# Altium project Angler_Main_PCB_V2.PrjPcb
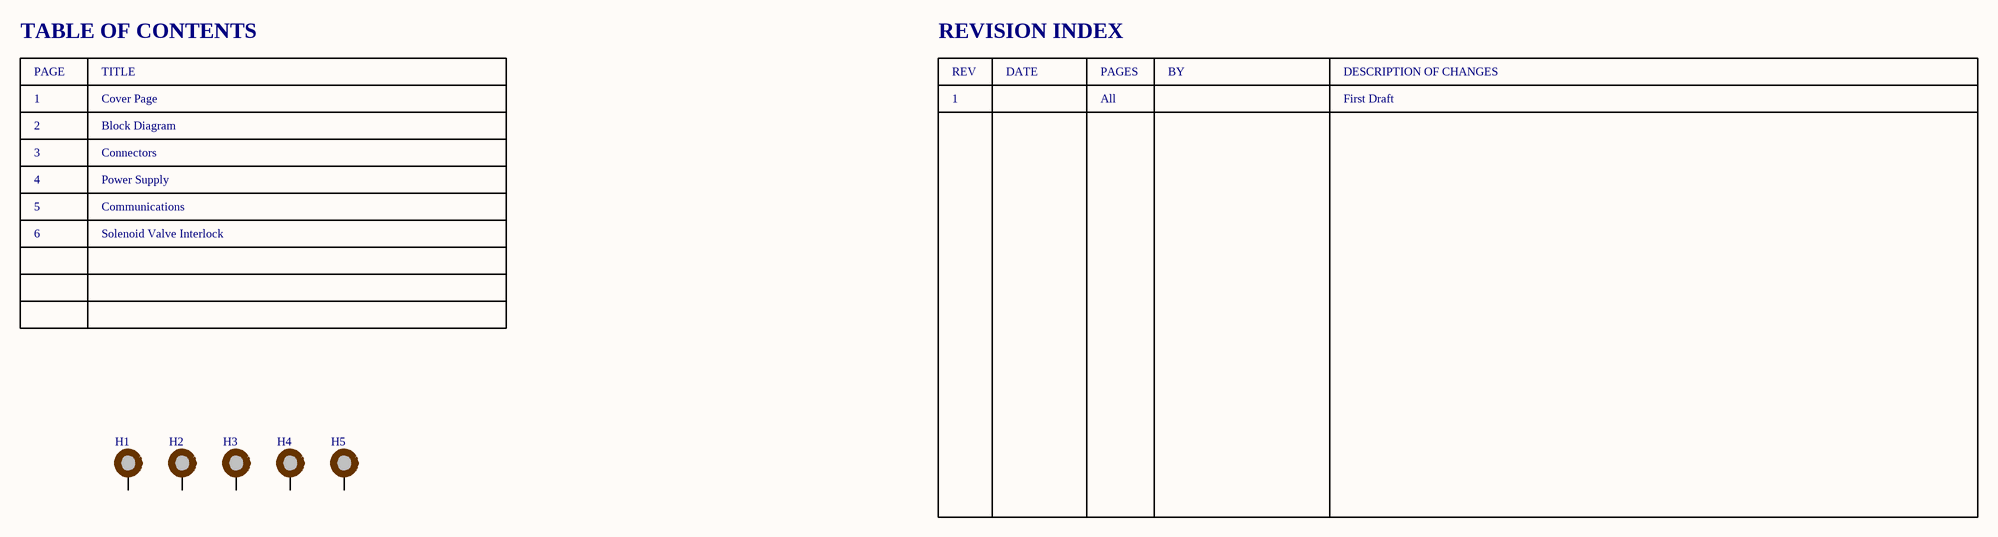
[diagram p0: S1_Cover_Page.SchDoc]
Copyright: Copyright 2020; DrawnBy: Dhrumil Parikh; PageSize: T; PCBDate: 01-Mar-2020; PCBName: AquaDrone Main PCB V2; PCBPartNumber: AD-PCB-002; PCBRevision: 1.0; ProjectTitle: AquaDrone Main PCB V2; SchDate: 01-Mar-2020; SchDrawnBy: Dhrumil Parikh; SchNumber: AD-SCH-002; SchRevision: 1; SheetTotal: 5
6 sheets, 202 parts. Net scope: flat (ports and power ports of the same name join across sheets).
Board file: AquaDrone_Main_PCB_V2.PcbDoc
Sheets:
  S1_Cover_Page.SchDoc
  S2_Block_Diagram.SchDoc
  S3_Connectors.SchDoc
  S4_Power_Supply.SchDoc
  S5_Communications.SchDoc
  S6_Solenoid_Valve_Interlock.SchDoc

## Sheet S1_Cover_Page.SchDoc: Cover Page
size Tabloid; DrawnBy: Dhrumil Parikh; SheetNumber: 1; SheetTotal: 6; PageSetup: Record=PageOptions|CenterHorizontal=True|CenterVertical=True|PrintScale=0.62|XCorrection=1.00|YCorrection=1.00|PrintKind=1|BorderSize=5000000|LeftOffset=0|BottomOffset=0|Orientation=2|PaperLength=1000|PaperWidth=1000|Scale=100|PaperSource=7|PrintQuality=600|MediaType=1|DitherType=10|PaperKind=Letter|PrintScaleMode=1; PageSize: T

### Parts
H1  MTG_HOLE PTH, 3.0mm  [MH_PTH_H3.0mmXP6.0mm]  (value not drawn)  (no BOM)
H2  MTG_HOLE PTH, 3.0mm  [MH_PTH_H3.0mmXP6.0mm]  (value not drawn)  (no BOM)
H3  MTG_HOLE PTH, 3.0mm  [MH_PTH_H3.0mmXP6.0mm]  (value not drawn)  (no BOM)
H4  MTG_HOLE PTH, 3.0mm  [MH_PTH_H3.0mmXP6.0mm]  (value not drawn)  (no BOM)
H5  MTG_HOLE PTH, 3.0mm  [MH_PTH_H3.0mmXP6.0mm]  (value not drawn)  (no BOM)

### Nets

Not connected (* = marked no-connect by the designer): H1 1; H2 1; H3 1; H4 1; H5 1

### Notes on the sheet
- TABLE OF CONTENTS
- PAGE
- 1
- TITLE
- Cover Page
- REVISION INDEX
- REV
- DATE
- PAGES
- All
- BY
- DESCRIPTION OF CHANGES
- First Draft
- 2
- 3
- Block Diagram
- Connectors
- 4
- 5
- 6
- Power Supply
- Communications
- Solenoid Valve Interlock
- Title:
- Project:
- Size:
- Date:
- DrawnBy:
- Rev:
- Project Lead:
- Sheet
- Dhrumil Parikh
- of
- 200 University Ave W
- Waterloo, ON
- N2L 3G1, Canada
- File:

### Library data of the parts
H1-H5 = MTG_HOLE PTH, 3.0mm: PTH, 3.0mm; VALUE: PTH_3.0MM

## Sheet S2_Block_Diagram.SchDoc: Block Diagram
size Tabloid; DrawnBy: Dhrumil Parikh; SheetNumber: 2; SheetTotal: 6; PageSetup: Record=PageOptions|CenterHorizontal=True|CenterVertical=True|PrintScale=0.62|XCorrection=1.00|YCorrection=1.00|PrintKind=1|BorderSize=5000000|LeftOffset=0|BottomOffset=0|Orientation=2|PaperLength=1000|PaperWidth=1000|Scale=100|PaperSource=7|PrintQuality=600|MediaType=1|DitherType=10|PaperKind=Letter|PrintScaleMode=1; PageSize: T

### Notes on the sheet
- Title:
- Project:
- Size:
- Date:
- DrawnBy:
- Rev:
- Project Lead:
- Sheet
- Dhrumil Parikh
- of
- 200 University Ave W
- Waterloo, ON
- N2L 3G1, Canada
- File:

## Sheet S3_Connectors.SchDoc: Connectors
size Tabloid; DrawnBy: Dhrumil Parikh; SheetNumber: 3; SheetTotal: 6; PageSetup: Record=PageOptions|CenterHorizontal=True|CenterVertical=True|PrintScale=0.62|XCorrection=1.00|YCorrection=1.00|PrintKind=1|BorderSize=5000000|LeftOffset=0|BottomOffset=0|Orientation=2|PaperLength=1000|PaperWidth=1000|Scale=100|PaperSource=7|PrintQuality=600|MediaType=1|DitherType=10|PaperKind=Letter|PrintScaleMode=1; PageSize: T
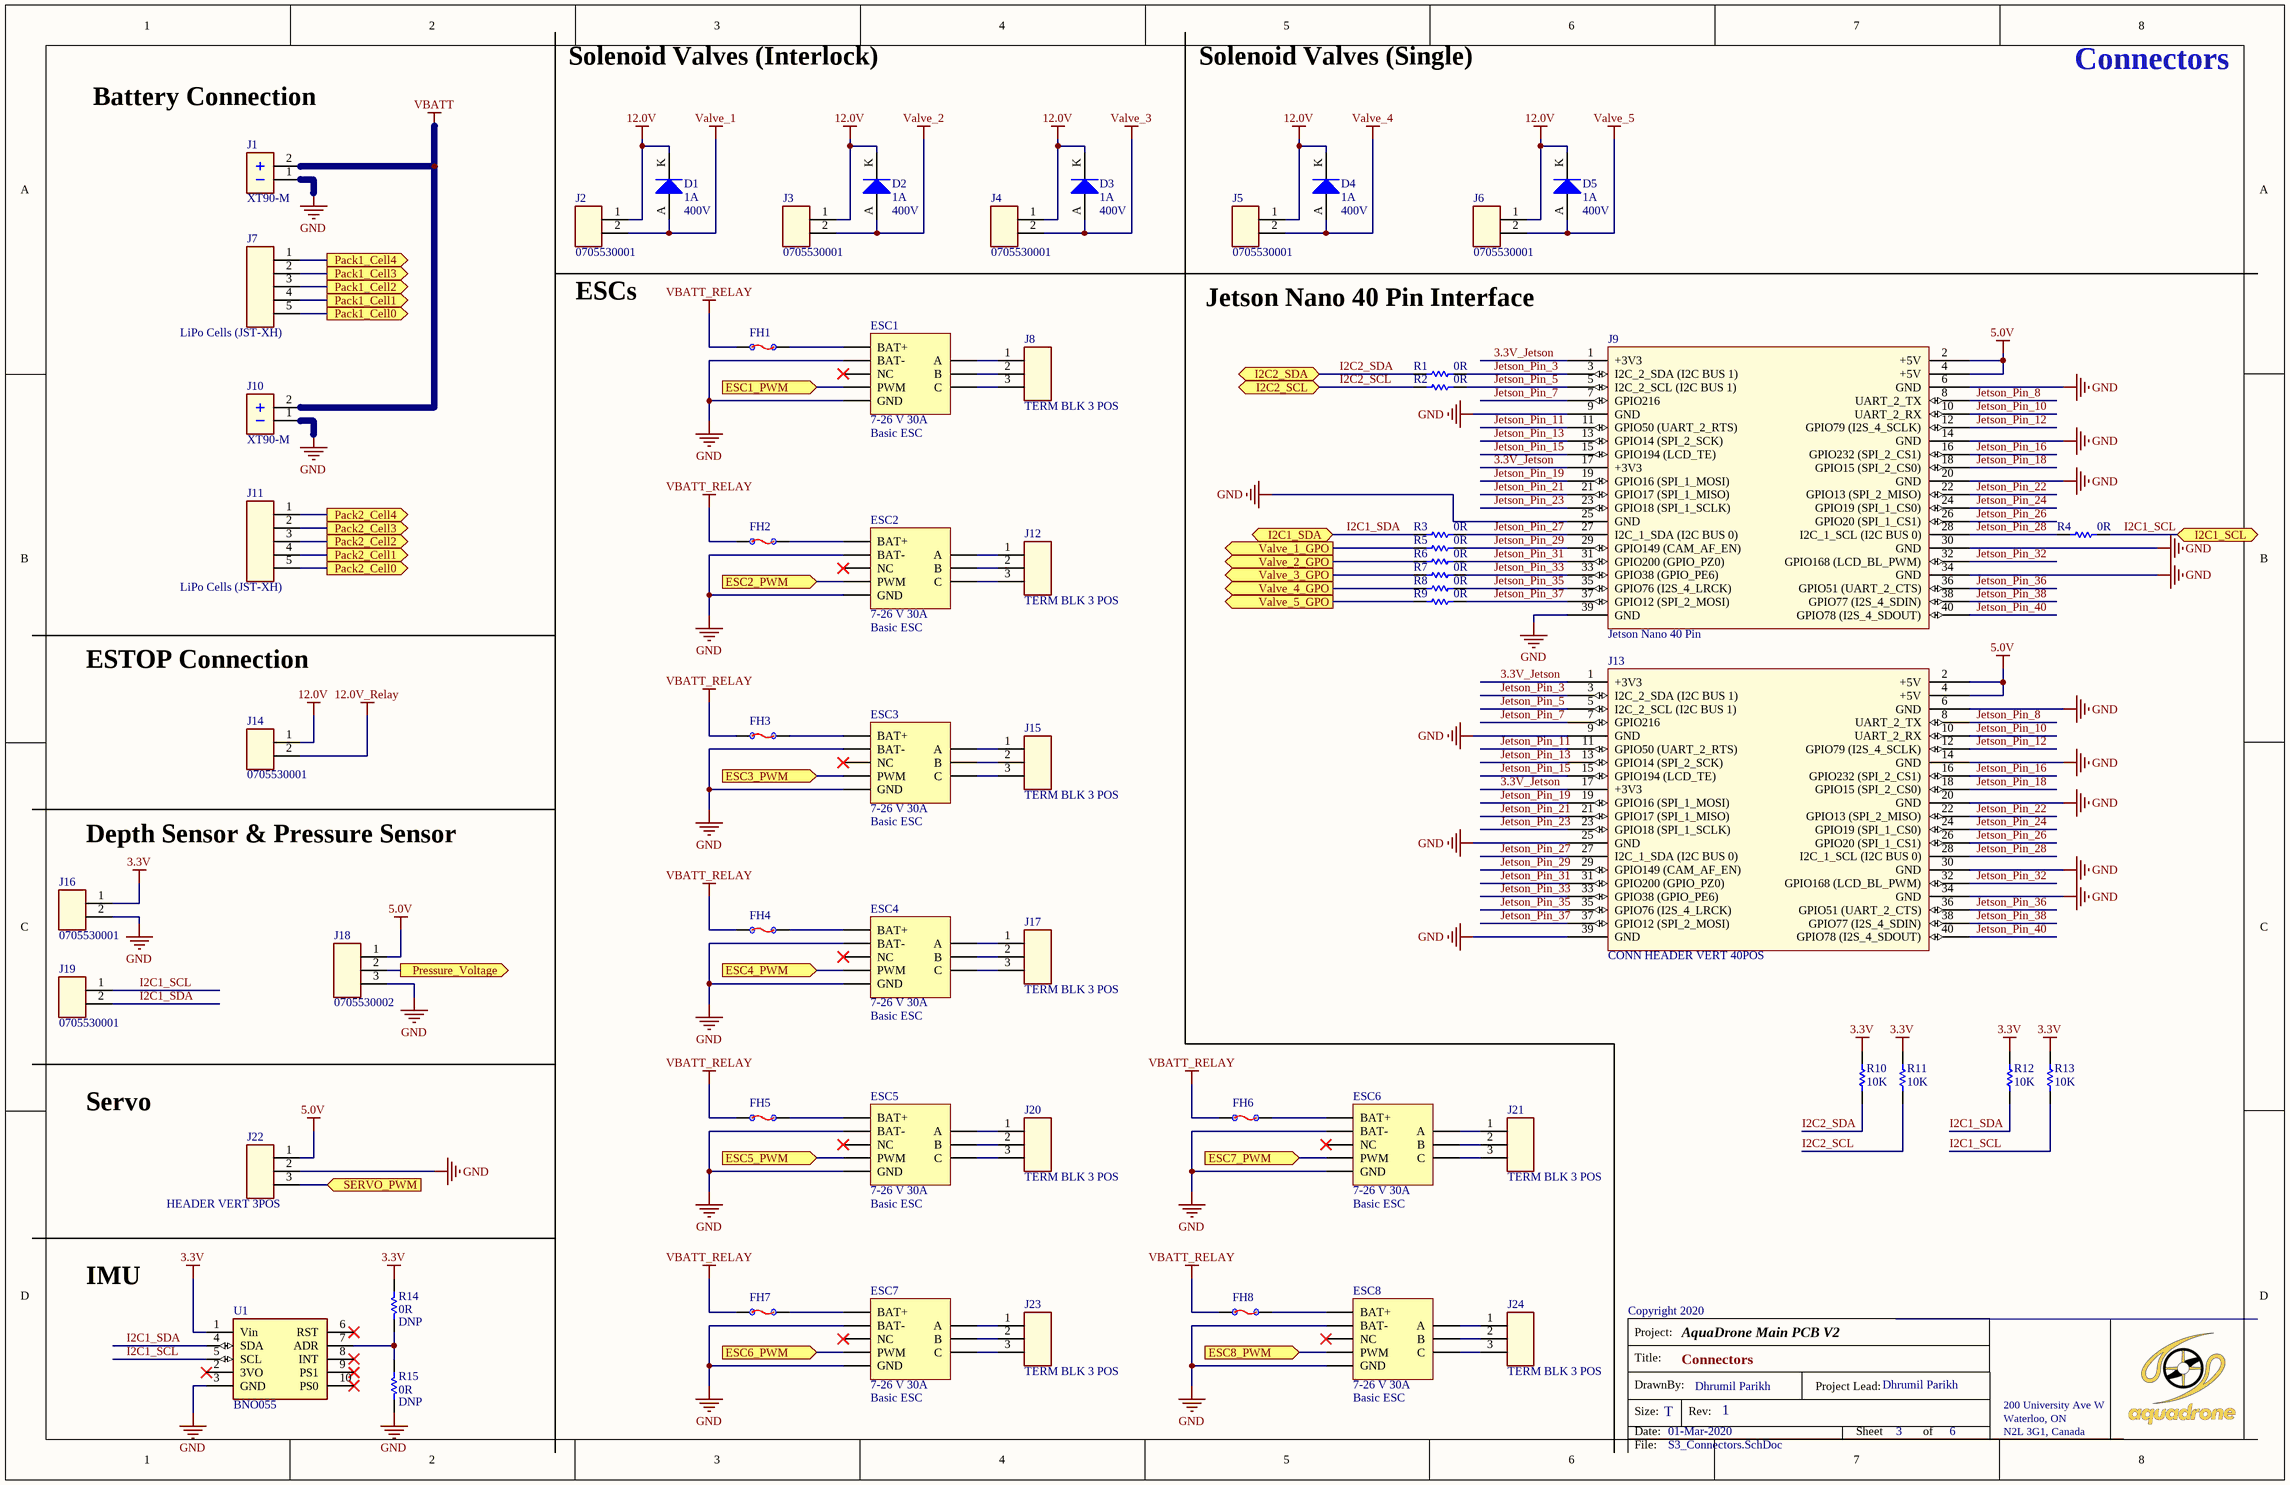
[diagram p1: S3_Connectors.SchDoc]

### Parts
D1  CURRENT: 1A  VR: 400V  [DIOM5226X295N]  (hidden comment: DIODE GEN PURP 400V 1A SMA)
D2  CURRENT: 1A  VR: 400V  [DIOM5226X295N]  (hidden comment: DIODE GEN PURP 400V 1A SMA)
D3  CURRENT: 1A  VR: 400V  [DIOM5226X295N]  (hidden comment: DIODE GEN PURP 400V 1A SMA)
D4  CURRENT: 1A  VR: 400V  [DIOM5226X295N]  (hidden comment: DIODE GEN PURP 400V 1A SMA)
D5  CURRENT: 1A  VR: 400V  [DIOM5226X295N]  (hidden comment: DIODE GEN PURP 400V 1A SMA)
ESC1  VOLTAGE: 7-26 V 30A  [ESC BR]  (hidden comment: Basic ESC)
ESC2  VOLTAGE: 7-26 V 30A  [ESC BR]  (hidden comment: Basic ESC)
ESC3  VOLTAGE: 7-26 V 30A  [ESC BR]  (hidden comment: Basic ESC)
ESC4  VOLTAGE: 7-26 V 30A  [ESC BR]  (hidden comment: Basic ESC)
ESC5  VOLTAGE: 7-26 V 30A  [ESC BR]  (hidden comment: Basic ESC)
ESC6  VOLTAGE: 7-26 V 30A  [ESC BR]  (hidden comment: Basic ESC)
ESC7  VOLTAGE: 7-26 V 30A  [ESC BR]  (hidden comment: Basic ESC)
ESC8  VOLTAGE: 7-26 V 30A  [ESC BR]  (hidden comment: Basic ESC)
FH1  FUSE BLOK CARTRIDGE 600V 16A PCB  [FUSE-HOLDER(5X20)]  (value not drawn)
FH2  FUSE BLOK CARTRIDGE 600V 16A PCB  [FUSE-HOLDER(5X20)]  (value not drawn)
FH3  FUSE BLOK CARTRIDGE 600V 16A PCB  [FUSE-HOLDER(5X20)]  (value not drawn)
FH4  FUSE BLOK CARTRIDGE 600V 16A PCB  [FUSE-HOLDER(5X20)]  (value not drawn)
FH5  FUSE BLOK CARTRIDGE 600V 16A PCB  [FUSE-HOLDER(5X20)]  (value not drawn)
FH6  FUSE BLOK CARTRIDGE 600V 16A PCB  [FUSE-HOLDER(5X20)]  (value not drawn)
FH7  FUSE BLOK CARTRIDGE 600V 16A PCB  [FUSE-HOLDER(5X20)]  (value not drawn)
FH8  FUSE BLOK CARTRIDGE 600V 16A PCB  [FUSE-HOLDER(5X20)]  (value not drawn)
J1  value XT90-M  [XT90]  (hidden comment: CONN XT90 MALE)
J2  value 0705530001  [SHDRRA2W109P0_254_1X2_762X1359X699P]  (hidden comment: CONN HEADER R/A 2POS 2.54MM)
J3  value 0705530001  [SHDRRA2W109P0_254_1X2_762X1359X699P]  (hidden comment: CONN HEADER R/A 2POS 2.54MM)
J4  value 0705530001  [SHDRRA2W109P0_254_1X2_762X1359X699P]  (hidden comment: CONN HEADER R/A 2POS 2.54MM)
J5  value 0705530001  [SHDRRA2W109P0_254_1X2_762X1359X699P]  (hidden comment: CONN HEADER R/A 2POS 2.54MM)
J6  value 0705530001  [SHDRRA2W109P0_254_1X2_762X1359X699P]  (hidden comment: CONN HEADER R/A 2POS 2.54MM)
J7  value LiPo Cells (JST-XH)  [SHDR5W64P0X250_1X5_1490X1150X610P]  (hidden comment: CONN HEADER R/A 5POS 2.5MM)
J8  value TERM BLK 3 POS  [SHDR3W100P0X254_1X3_808X650X1030P]  (hidden comment: TERM BLK 3P SIDE ENT 2.54MM PCB)
J9  value Jetson Nano 40 Pin  [Jetson Nano]  (hidden comment: Jetson Nano 40 Pin Interface)
J10  value XT90-M  [XT90]  (hidden comment: CONN XT90 MALE)
J11  value LiPo Cells (JST-XH)  [SHDR5W64P0X250_1X5_1490X1150X610P]  (hidden comment: CONN HEADER R/A 5POS 2.5MM)
J12  value TERM BLK 3 POS  [SHDR3W100P0X254_1X3_808X650X1030P]  (hidden comment: TERM BLK 3P SIDE ENT 2.54MM PCB)
J13  value CONN HEADER VERT 40POS  [67997-140HLF]  (hidden comment: CONN HEADER VERT 40POS 2.54MM)
J14  value 0705530001  [SHDRRA2W109P0_254_1X2_762X1359X699P]  (hidden comment: CONN HEADER R/A 2POS 2.54MM)
J15  value TERM BLK 3 POS  [SHDR3W100P0X254_1X3_808X650X1030P]  (hidden comment: TERM BLK 3P SIDE ENT 2.54MM PCB)
J16  value 0705530001  [SHDRRA2W109P0_254_1X2_762X1359X699P]  (hidden comment: CONN HEADER R/A 2POS 2.54MM)
J17  value TERM BLK 3 POS  [SHDR3W100P0X254_1X3_808X650X1030P]  (hidden comment: TERM BLK 3P SIDE ENT 2.54MM PCB)
J18  value 0705530002  [SHDR3W89P0X254_1X3_1017X1359X699P]  (hidden comment: CONN HEADER R/A 3POS 2.54MM)
J19  value 0705530001  [SHDRRA2W109P0_254_1X2_762X1359X699P]  (hidden comment: CONN HEADER R/A 2POS 2.54MM)
J20  value TERM BLK 3 POS  [SHDR3W100P0X254_1X3_808X650X1030P]  (hidden comment: TERM BLK 3P SIDE ENT 2.54MM PCB)
J21  value TERM BLK 3 POS  [SHDR3W100P0X254_1X3_808X650X1030P]  (hidden comment: TERM BLK 3P SIDE ENT 2.54MM PCB)
J22  value HEADER VERT 3POS  [61300311121]  (hidden comment: CONN HEADER VERT 3POS 2.54MM)
J23  value TERM BLK 3 POS  [SHDR3W100P0X254_1X3_808X650X1030P]  (hidden comment: TERM BLK 3P SIDE ENT 2.54MM PCB)
J24  value TERM BLK 3 POS  [SHDR3W100P0X254_1X3_808X650X1030P]  (hidden comment: TERM BLK 3P SIDE ENT 2.54MM PCB)
R1  value 0R  [RESC2012X07N]  (hidden comment: RES SMD 0 OHM JUMPER 1/8W 0805)
R2  value 0R  [RESC2012X07N]  (hidden comment: RES SMD 0 OHM JUMPER 1/8W 0805)
R3  value 0R  [RESC2012X07N]  (hidden comment: RES SMD 0 OHM JUMPER 1/8W 0805)
R4  value 0R  [RESC2012X07N]  (hidden comment: RES SMD 0 OHM JUMPER 1/8W 0805)
R5  value 0R  [RESC2012X07N]  (hidden comment: RES SMD 0 OHM JUMPER 1/8W 0805)
R6  value 0R  [RESC2012X07N]  (hidden comment: RES SMD 0 OHM JUMPER 1/8W 0805)
R7  value 0R  [RESC2012X07N]  (hidden comment: RES SMD 0 OHM JUMPER 1/8W 0805)
R8  value 0R  [RESC2012X07N]  (hidden comment: RES SMD 0 OHM JUMPER 1/8W 0805)
R9  value 0R  [RESC2012X07N]  (hidden comment: RES SMD 0 OHM JUMPER 1/8W 0805)
R10  value 10K  [RESC1608X06N]  (hidden comment: RES SMD 10K OHM 1% 1/10W 0603)
R11  value 10K  [RESC1608X06N]  (hidden comment: RES SMD 10K OHM 1% 1/10W 0603)
R12  value 10K  [RESC1608X06N]  (hidden comment: RES SMD 10K OHM 1% 1/10W 0603)
R13  value 10K  [RESC1608X06N]  (hidden comment: RES SMD 10K OHM 1% 1/10W 0603)
R14  value 0R  NOSTUFF: DNP  [RESC2012X07N]  (hidden comment: RES SMD 0 OHM JUMPER 1/8W 0805)
R15  value 0R  NOSTUFF: DNP  [RESC2012X07N]  (hidden comment: RES SMD 0 OHM JUMPER 1/8W 0805)
U1  IC BNO055  [BNO055]  (value not drawn)

### Ports
ESC1_PWM (in), ESC2_PWM (in), ESC3_PWM (in), ESC4_PWM (in), ESC5_PWM (in), ESC6_PWM (in), ESC7_PWM (in), ESC8_PWM (in), I2C1_SCL (bidir), I2C1_SDA (bidir), I2C2_SCL (bidir), I2C2_SDA (bidir), Pack1_Cell0 (out), Pack1_Cell1 (out), Pack1_Cell2 (out), Pack1_Cell3 (out), Pack1_Cell4 (out), Pack2_Cell0 (out), Pack2_Cell1 (out), Pack2_Cell2 (out), Pack2_Cell3 (out), Pack2_Cell4 (out), Pressure_Voltage (out), SERVO_PWM (in), Valve_1_GPO (out), Valve_2_GPO (out), Valve_3_GPO (out), Valve_4_GPO (out), Valve_5_GPO (out)

### Nets
3.3V: J16.1 R10.2 R11.2 R12.2 R13.2 R14.1 U1.1(Vin)
5.0V: J9.2(+5V) J9.4(+5V) J13.2(+5V) J13.4(+5V) J18.1 J22.1
12.0V: D1.K D2.K D3.K D4.K D5.K J2.1 J3.1 J4.1 J5.1 J6.1 J14.1
12.0V_Relay: J14.2
GND: ESC1.BAT- ESC1.GND ESC2.BAT- ESC2.GND ESC3.BAT- ESC3.GND ESC4.BAT- ESC4.GND ESC5.BAT- ESC5.GND ESC6.BAT- ESC6.GND ESC7.BAT- ESC7.GND ESC8.BAT- ESC8.GND J1.1 J9.6(GND) J9.9(GND) J9.14(GND) J9.20(GND) J9.25(GND) J9.30(GND) J9.34(GND) J9.39(GND) J10.1 J13.6(GND) J13.9(GND) J13.14(GND) J13.20(GND) J13.25(GND) J13.30(GND) J13.34(GND) J13.39(GND) J16.2 J18.3 J22.2 R15.2 U1.3(GND)
Valve_1: D1.A J2.2
Valve_2: D2.A J3.2
Valve_3: D3.A J4.2
Valve_4: D4.A J5.2
Valve_5: D5.A J6.2
VBATT: J1.2 J10.2
VBATT_RELAY: FH1.1 FH2.1 FH3.1 FH4.1 FH5.1 FH6.1 FH7.1 FH8.1
3.3V_Jetson: J9.1(+3V3) J9.17(+3V3) J13.1(+3V3) J13.17(+3V3)  [project net 3.3V_Jetson_3]
ESC1_PWM: ESC1.PWM ; port ESC1_PWM
ESC2_PWM: ESC2.PWM ; port ESC2_PWM
ESC3_PWM: ESC3.PWM ; port ESC3_PWM
ESC4_PWM: ESC4.PWM ; port ESC4_PWM
ESC5_PWM: ESC5.PWM ; port ESC5_PWM
ESC6_PWM: ESC7.PWM ; port ESC6_PWM
ESC7_PWM: ESC6.PWM ; port ESC7_PWM
ESC8_PWM: ESC8.PWM ; port ESC8_PWM
I2C1_SCL: J19.1 R4.2 R13.1 U1.5(SCL) ; port I2C1_SCL
I2C1_SDA: J19.2 R3.1 R12.1 U1.4(SDA) ; port I2C1_SDA
I2C2_SCL: R2.1 R11.1 ; port I2C2_SCL
I2C2_SDA: R1.1 R10.1 ; port I2C2_SDA
Jetson_Pin_3: J9.3(I2C_2_SDA_(I2C_BUS_1)) J13.3(I2C_2_SDA_(I2C_BUS_1)) R1.2  [project net Jetson_Pin_3_3]
Jetson_Pin_5: J9.5(I2C_2_SCL_(I2C_BUS_1)) J13.5(I2C_2_SCL_(I2C_BUS_1)) R2.2  [project net Jetson_Pin_5_3]
Jetson_Pin_7: J9.7(GPIO216) J13.7(GPIO216)  [project net Jetson_Pin_7_3]
Jetson_Pin_8: J9.8(UART_2_TX) J13.8(UART_2_TX)  [project net Jetson_Pin_8_3]
Jetson_Pin_10: J9.10(UART_2_RX) J13.10(UART_2_RX)  [project net Jetson_Pin_10_3]
Jetson_Pin_11: J9.11(GPIO50_(UART_2_RTS)) J13.11(GPIO50_(UART_2_RTS))  [project net Jetson_Pin_11_3]
Jetson_Pin_12: J9.12(GPIO79_(I2S_4_SCLK)) J13.12(GPIO79_(I2S_4_SCLK))  [project net Jetson_Pin_12_3]
Jetson_Pin_13: J9.13(GPIO14_(SPI_2_SCK)) J13.13(GPIO14_(SPI_2_SCK))  [project net Jetson_Pin_13_3]
Jetson_Pin_15: J9.15(GPIO194_(LCD_TE)) J13.15(GPIO194_(LCD_TE))  [project net Jetson_Pin_15_3]
Jetson_Pin_16: J9.16(GPIO232_(SPI_2_CS1)) J13.16(GPIO232_(SPI_2_CS1))  [project net Jetson_Pin_16_3]
Jetson_Pin_18: J9.18(GPIO15_(SPI_2_CS0)) J13.18(GPIO15_(SPI_2_CS0))  [project net Jetson_Pin_18_3]
Jetson_Pin_19: J9.19(GPIO16_(SPI_1_MOSI)) J13.19(GPIO16_(SPI_1_MOSI))  [project net Jetson_Pin_19_3]
Jetson_Pin_21: J9.21(GPIO17_(SPI_1_MISO)) J13.21(GPIO17_(SPI_1_MISO))  [project net Jetson_Pin_21_3]
Jetson_Pin_22: J9.22(GPIO13_(SPI_2_MISO)) J13.22(GPIO13_(SPI_2_MISO))  [project net Jetson_Pin_22_3]
Jetson_Pin_23: J9.23(GPIO18_(SPI_1_SCLK)) J13.23(GPIO18_(SPI_1_SCLK))  [project net Jetson_Pin_23_3]
Jetson_Pin_24: J9.24(GPIO19_(SPI_1_CS0)) J13.24(GPIO19_(SPI_1_CS0))  [project net Jetson_Pin_24_3]
Jetson_Pin_26: J9.26(GPIO20_(SPI_1_CS1)) J13.26(GPIO20_(SPI_1_CS1))  [project net Jetson_Pin_26_3]
Jetson_Pin_27: J9.27(I2C_1_SDA_(I2C_BUS_0)) J13.27(I2C_1_SDA_(I2C_BUS_0)) R3.2  [project net Jetson_Pin_27_3]
Jetson_Pin_28: J9.28(I2C_1_SCL_(I2C_BUS_0)) J13.28(I2C_1_SCL_(I2C_BUS_0)) R4.1  [project net Jetson_Pin_28_3]
Jetson_Pin_29: J9.29(GPIO149_(CAM_AF_EN)) J13.29(GPIO149_(CAM_AF_EN)) R5.2  [project net Jetson_Pin_29_3]
Jetson_Pin_31: J9.31(GPIO200_(GPIO_PZ0)) J13.31(GPIO200_(GPIO_PZ0)) R6.2  [project net Jetson_Pin_31_3]
Jetson_Pin_32: J9.32(GPIO168_(LCD_BL_PWM)) J13.32(GPIO168_(LCD_BL_PWM))  [project net Jetson_Pin_32_3]
Jetson_Pin_33: J9.33(GPIO38_(GPIO_PE6)) J13.33(GPIO38_(GPIO_PE6)) R7.2  [project net Jetson_Pin_33_3]
Jetson_Pin_35: J9.35(GPIO76_(I2S_4_LRCK)) J13.35(GPIO76_(I2S_4_LRCK)) R8.2  [project net Jetson_Pin_35_3]
Jetson_Pin_36: J9.36(GPIO51_(UART_2_CTS)) J13.36(GPIO51_(UART_2_CTS))  [project net Jetson_Pin_36_3]
Jetson_Pin_37: J9.37(GPIO12_(SPI_2_MOSI)) J13.37(GPIO12_(SPI_2_MOSI)) R9.2  [project net Jetson_Pin_37_3]
Jetson_Pin_38: J9.38(GPIO77_(I2S_4_SDIN)) J13.38(GPIO77_(I2S_4_SDIN))  [project net Jetson_Pin_38_3]
Jetson_Pin_40: J9.40(GPIO78_(I2S_4_SDOUT)) J13.40(GPIO78_(I2S_4_SDOUT))  [project net Jetson_Pin_40_3]
Pack1_Cell0: J7.5 ; port Pack1_Cell0
Pack1_Cell1: J7.4 ; port Pack1_Cell1
Pack1_Cell2: J7.3 ; port Pack1_Cell2
Pack1_Cell3: J7.2 ; port Pack1_Cell3
Pack1_Cell4: J7.1 ; port Pack1_Cell4
Pack2_Cell0: J11.5 ; port Pack2_Cell0
Pack2_Cell1: J11.4 ; port Pack2_Cell1
Pack2_Cell2: J11.3 ; port Pack2_Cell2
Pack2_Cell3: J11.2 ; port Pack2_Cell3
Pack2_Cell4: J11.1 ; port Pack2_Cell4
Pressure_Voltage: J18.2 ; port Pressure_Voltage
SERVO_PWM: J22.3 ; port SERVO_PWM
Valve_1_GPO: R5.1 ; port Valve_1_GPO
Valve_2_GPO: R6.1 ; port Valve_2_GPO
Valve_3_GPO: R7.1 ; port Valve_3_GPO
Valve_4_GPO: R8.1 ; port Valve_4_GPO
Valve_5_GPO: R9.1 ; port Valve_5_GPO
NetESC1_A: ESC1.A J8.1
NetESC1_B: ESC1.B J8.2
NetESC1_BAT+: ESC1.BAT+ FH1.2
NetESC1_C: ESC1.C J8.3
NetESC2_A: ESC2.A J12.1
NetESC2_B: ESC2.B J12.2
NetESC2_BAT+: ESC2.BAT+ FH2.2
NetESC2_C: ESC2.C J12.3
NetESC3_A: ESC3.A J15.1
NetESC3_B: ESC3.B J15.2
NetESC3_BAT+: ESC3.BAT+ FH3.2
NetESC3_C: ESC3.C J15.3
NetESC4_A: ESC4.A J17.1
NetESC4_B: ESC4.B J17.2
NetESC4_BAT+: ESC4.BAT+ FH4.2
NetESC4_C: ESC4.C J17.3
NetESC5_A: ESC5.A J20.1
NetESC5_B: ESC5.B J20.2
NetESC5_BAT+: ESC5.BAT+ FH5.2
NetESC5_C: ESC5.C J20.3
NetESC6_A: ESC6.A J21.1
NetESC6_B: ESC6.B J21.2
NetESC6_BAT+: ESC6.BAT+ FH6.2
NetESC6_C: ESC6.C J21.3
NetESC7_A: ESC7.A J23.1
NetESC7_B: ESC7.B J23.2
NetESC7_BAT+: ESC7.BAT+ FH7.2
NetESC7_C: ESC7.C J23.3
NetESC8_A: ESC8.A J24.1
NetESC8_B: ESC8.B J24.2
NetESC8_BAT+: ESC8.BAT+ FH8.2
NetESC8_C: ESC8.C J24.3
NetR14_2: R14.2 R15.1 U1.7(ADR)

Not connected (* = marked no-connect by the designer): ESC1 NC*; ESC2 NC*; ESC3 NC*; ESC4 NC*; ESC5 NC*; ESC6 NC*; ESC7 NC*; ESC8 NC*; U1 2(3VO)* 6(RST)* 8(INT)* 9(PS1)* 10(PS0)*

### Notes on the sheet
- Solenoid Valves (Interlock)
- Solenoid Valves (Single)
- Battery Connection
- (near J2) ESCs
- Jetson Nano 40 Pin Interface
- ESTOP Connection
- Depth Sensor & Pressure Sensor
- Servo
- IMU
- Title:
- Project:
- Size:
- Date:
- DrawnBy:
- Rev:
- Project Lead:
- Sheet
- Dhrumil Parikh
- of
- 200 University Ave W
- Waterloo, ON
- N2L 3G1, Canada
- File:

### Library data of the parts
D1-D5 = DIODE GEN PURP 400V 1A SMA: MFG_PART_NO: S1GTR; MFG: SMC Diode Solutions; VALUE: S1GTR; COST: 0.17
ESC1-ESC8 = Basic ESC: MFG_PART_NO: BESC30-R3; COST1K: 25; MFG: Blue Robotics; ROHS: Y; VALUE: Basic ESC
FH1-FH8 = FUSE BLOK CARTRIDGE 600V 16A PCB: MFG_PART_NO: 0031.8231; MFG: Schurter Inc.; HOLD: 14A; VALUE: Fuse Holder; TRIP: 15A; COST: 2.89; VOLTAGE: 600V
J1 J10 = CONN XT90 MALE: MFG_PART_NO: FIT0588; MFG: DFRobot; COST: 5.66000
J2-J6 J14 J16 J19 = CONN HEADER R/A 2POS 2.54MM: MFG: Molex; COST: 1.12; MFG_PART_NO: 0705530001
J7 J11 = CONN HEADER R/A 5POS 2.5MM: MFG_PART_NO: S5B-XH-A(LF)(SN); MFG: JST Sales America Inc.; COST: 0.43
J8 J12 J15 J17 J20 J21 J23 J24 = TERM BLK 3P SIDE ENT 2.54MM PCB: MFG_PART_NO: 282834-3; MFG: TE Connectivity; COST: 2.9
J13 = CONN HEADER VERT 40POS 2.54MM: MFG: Amphenol; COST: 4.1; MFG_PART_NO: 67997-140HLF
J18 = CONN HEADER R/A 3POS 2.54MM: MFG: Molex; COST: 1.47; MFG_PART_NO: 0705530002
J22 = CONN HEADER VERT 3POS 2.54MM: MFG: Wurth Electronics Inc.; COST: 0.18; MFG_PART_NO: 61300311121
R1-R9 R14 R15 = RES SMD 0 OHM JUMPER 1/8W 0805: MFG_PART_NO: ERJ-6GEY0R00V; MFG: Panasonic; COST: 0.15
R10-R13 = RES SMD 10K OHM 1% 1/10W 0603: MFG_PART_NO: CRCW060310K0FKEA; MFG: Vishay Dale; COST: 0.15; TOLERANCE: 1%
U1 = IC BNO055: MFG: Adafruit Industries LLC; COST: 50; VALUE: BNO055; MFG_PART_NO: BNO055
J9 = Jetson Nano 40 Pin Interface: COST: 60; MFG: Jetson; MFG_PART_NO: Nano

## Sheet S4_Power_Supply.SchDoc: Power Supply
size Tabloid; DrawnBy: Dhrumil Parikh; SheetNumber: 4; SheetTotal: 6; PageSetup: Record=PageOptions|CenterHorizontal=True|CenterVertical=True|PrintScale=0.62|XCorrection=1.00|YCorrection=1.00|PrintKind=1|BorderSize=5000000|LeftOffset=0|BottomOffset=0|Orientation=2|PaperLength=1000|PaperWidth=1000|Scale=100|PaperSource=7|PrintQuality=600|MediaType=1|DitherType=10|PaperKind=Letter|PrintScaleMode=1; PageSize: T
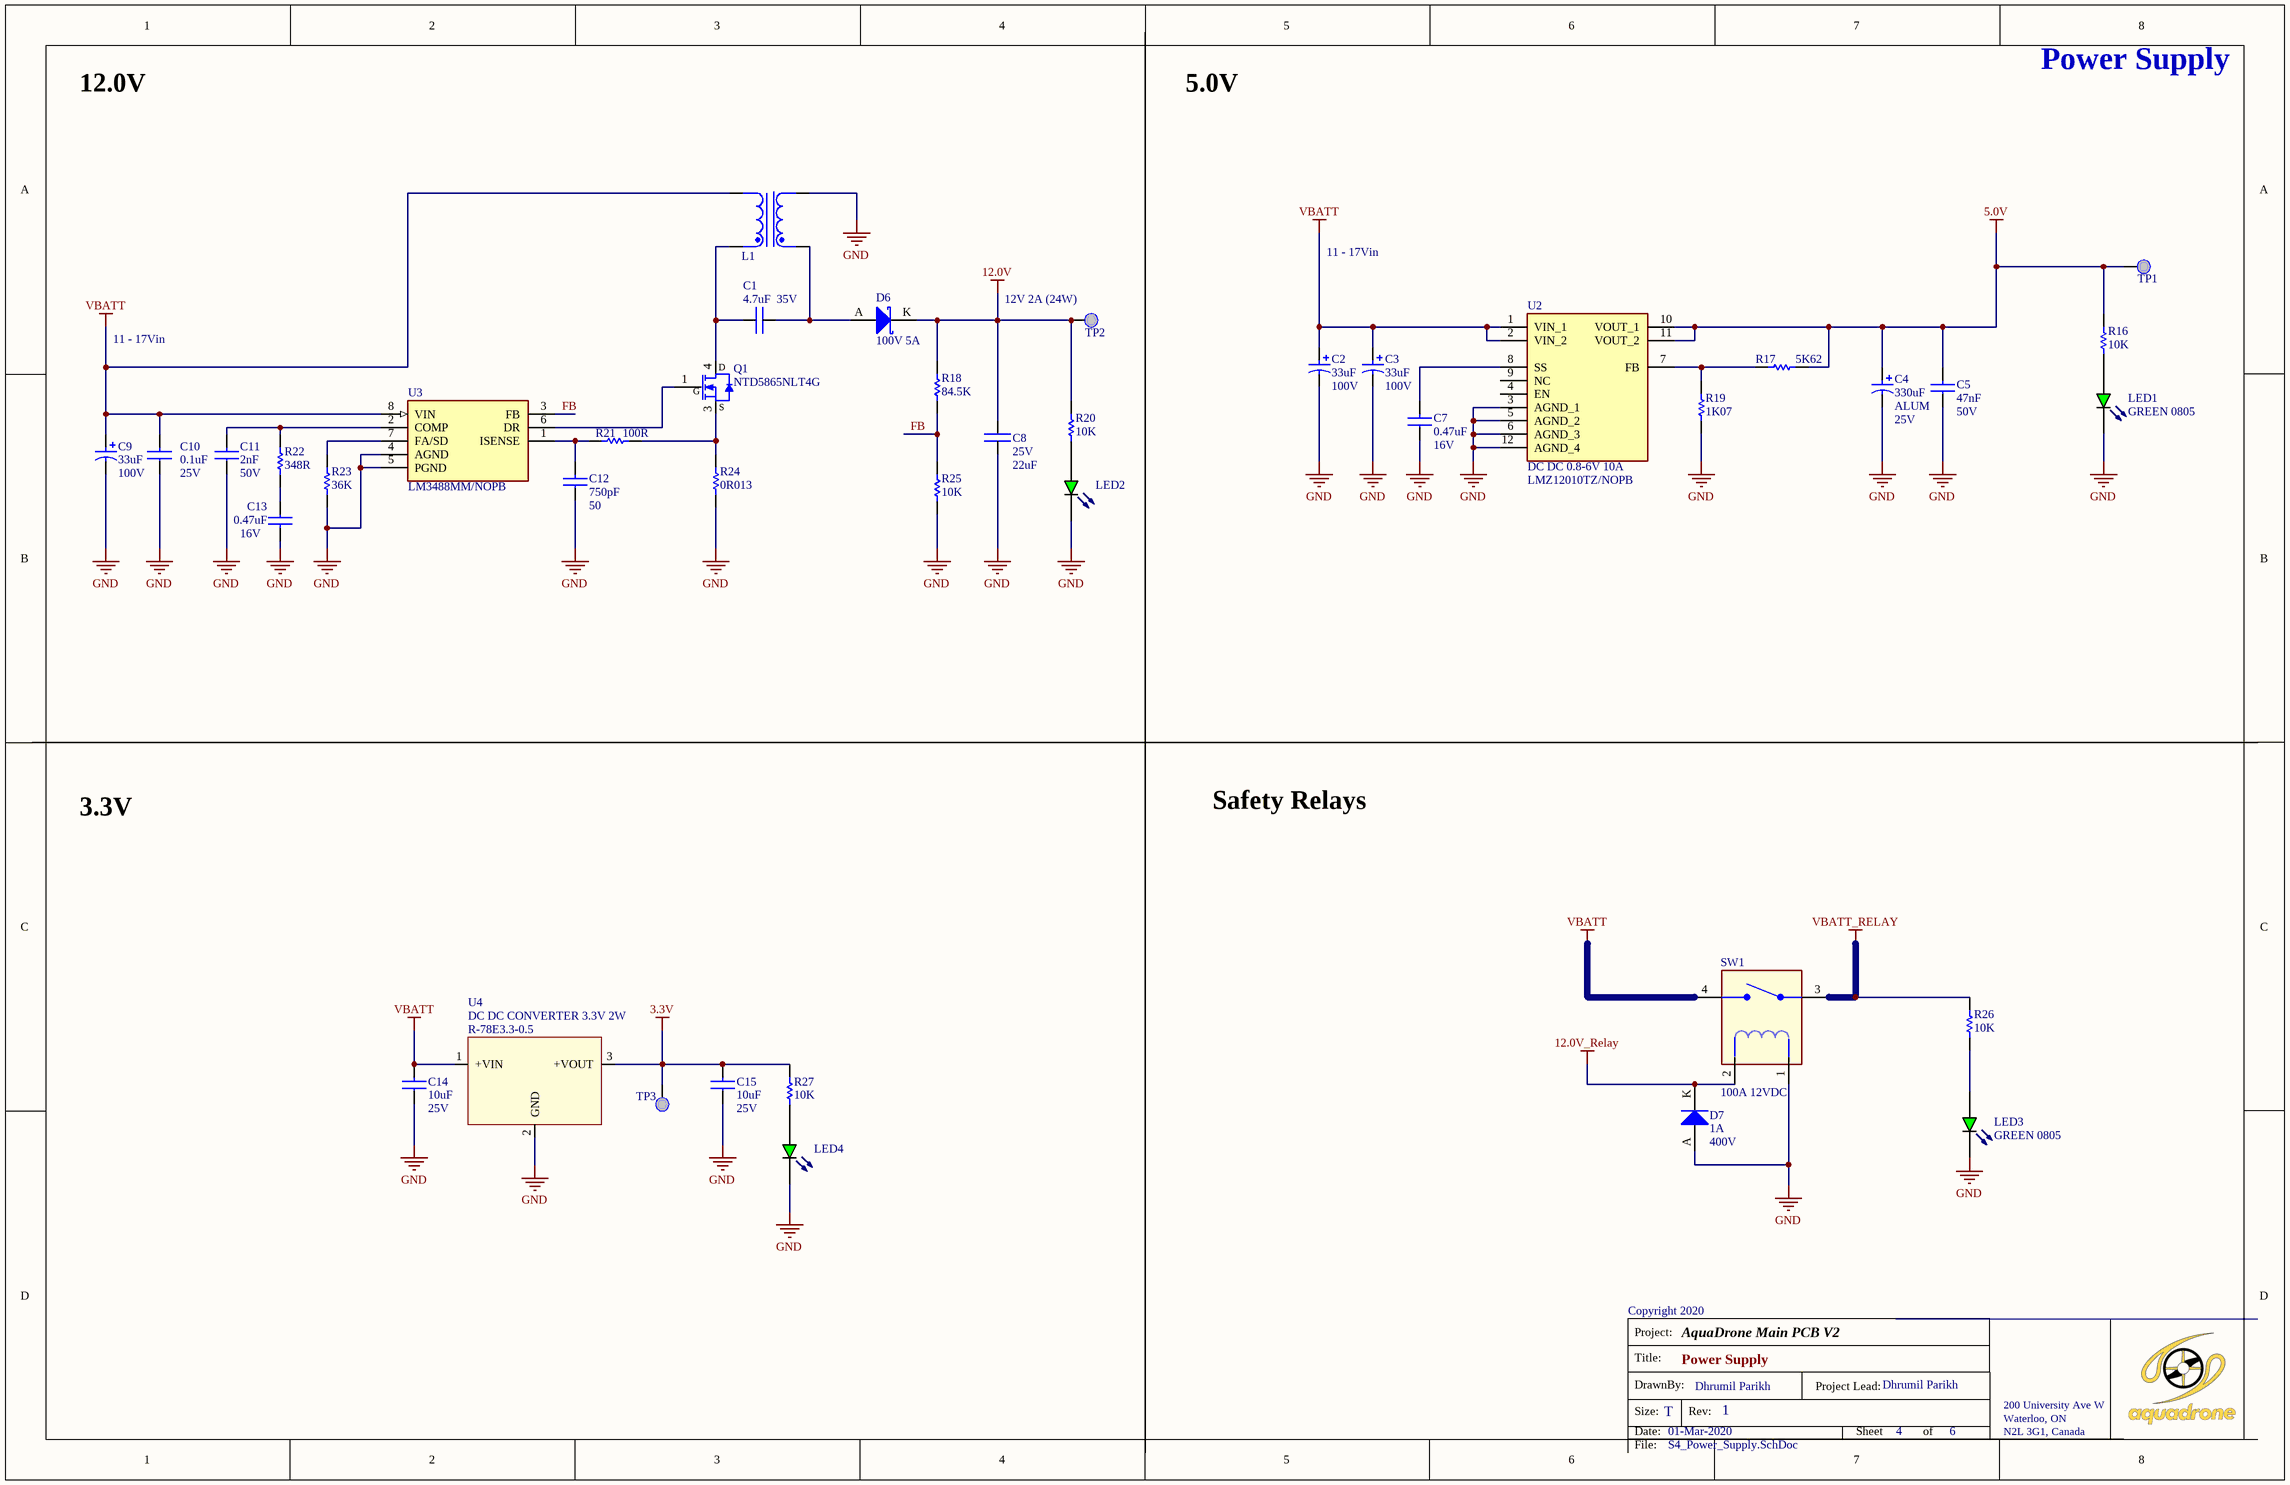
[diagram p2: S4_Power_Supply.SchDoc]

### Parts
C1  value 4.7uF  VOLTAGE: 35V  [CAPC2012X14N]  (hidden comment: CAP CER 4.7UF 35V X5R 0805)
C2  value 33uF  VOLTAGE: 100V  [CAPPRD350W60D825H1700]  (hidden comment: CAP ALUM 33UF 20% 100V RADIAL)
C3  value 33uF  VOLTAGE: 100V  [CAPPRD350W60D825H1700]  (hidden comment: CAP ALUM 33UF 20% 100V RADIAL)
C4  value 330uF  DIELECTRIC: ALUM  VOLTAGE: 25V  [CAPPRD350W60D850H1300]  (hidden comment: CAP ALUM 330UF 20% 25V TH)
C5  value 47nF  VOLTAGE: 50V  [CAPC1608X09N]  (hidden comment: CAP CER 0.047UF 50V X7R 0603)
C7  value 0.47uF  VOLTAGE: 16V  [CAPC1608X09N]  (hidden comment: CAP CER 0.47UF 16V X7R 0603)
C8  value 22uF  VOLTAGE: 25V  [CAPC3225X28N]  (hidden comment: CAP CER 22UF 25V X7R 1210)
C9  value 33uF  VOLTAGE: 100V  [CAPPRD350W60D825H1700]  (hidden comment: CAP ALUM 33UF 20% 100V RADIAL)
C10  value 0.1uF  VOLTAGE: 25V  [CAPC1608X09N]  (hidden comment: CAP CER 0.1UF 25V X7R 0603)
C11  value 2nF  VOLTAGE: 50V  [CAPC1608X09N]  (hidden comment: CAP CER 2000PF 50V X7R 0603)
C12  value 750pF  VOLTAGE: 50  [CAPC1608X09N]  (hidden comment: CAP CER 750PF 50V X7R 0603)
C13  value 0.47uF  VOLTAGE: 16V  [CAPC1608X09N]  (hidden comment: CAP CER 0.47UF 16V X7R 0603)
C14  value 10uF  VOLTAGE: 25V  [CAPC1608X09N]  (hidden comment: CAP CER 10UF 25V X5R 0603)
C15  value 10uF  VOLTAGE: 25V  [CAPC1608X09N]  (hidden comment: CAP CER 10UF 25V X5R 0603)
D6  value 100V 5A  [SODFL5226X100N]  (hidden comment: DIODE SCHOTTKY 100V 5A DO221AC)
D7  CURRENT: 1A  VR: 400V  [DIOM5226X295N]  (hidden comment: DIODE GEN PURP 400V 1A SMA)
L1  INDUCT ARRAY 2 COIL 9.654UH SMD  [DRQ125100R]  (value not drawn)
LED1  value GREEN 0805  [LED0805]  (hidden comment: LED GREEN CLEAR 0805 SMD)
LED2  LED GREEN CLEAR 0805 SMD  [LED0805]  (value not drawn)
LED3  value GREEN 0805  [LED0805]  (hidden comment: LED GREEN CLEAR 0805 SMD)
LED4  LED GREEN CLEAR 0805 SMD  [LED0805]  (value not drawn)
Q1  MFG_PART_NO: NTD5865NLT4G  [TO229P990X238-4N]  (hidden comment: MOSFET N-CH 60V 46A DPAK)
R16  value 10K  [RESC1608X06N]  (hidden comment: RES SMD 10K OHM 1% 1/10W 0603)
R17  value 5K62  [RESC1608X06N]  (hidden comment: RES SMD 5.62K OHM 1% 1/10W 0603)
R18  value 84.5K  [RESC1608X06N]  (hidden comment: RES SMD 84.5K OHM 1% 1/10W 0603)
R19  value 1K07  [RESC1608X06N]  (hidden comment: RES SMD 1.07K OHM 1% 1/10W 0603)
R20  value 10K  [RESC1608X06N]  (hidden comment: RES SMD 10K OHM 1% 1/10W 0603)
R21  value 100R  [RESC1608X06N]  (hidden comment: RES SMD 100 OHM 1% 1/10W 0603)
R22  value 348R  [RESC1608X06N]  (hidden comment: RES SMD 348 OHM 1% 1/10W 0603)
R23  value 36K  [RESC1608X06N]  (hidden comment: RES SMD 36K OHM 1% 0.15W 0603)
R24  value 0R013  [RESC1632X60N]  (hidden comment: RES 0.013 OHM 1W 1206 WIDE)
R25  value 10K  [RESC1608X06N]  (hidden comment: RES SMD 10K OHM 1% 1/10W 0603)
R26  value 10K  [RESC1608X06N]  (hidden comment: RES SMD 10K OHM 1% 1/10W 0603)
R27  value 10K  [RESC1608X06N]  (hidden comment: RES SMD 10K OHM 1% 1/10W 0603)
SW1  value 100A 12VDC  [G7EB-1A DC12]  (hidden comment: RELAY GEN PURPOSE SPST-NO 100A 12VDC)
TP1  Testpoint 1mm SMD Pad  [TP_SMD_1.0MM]  (value not drawn)  (no BOM)
TP2  Testpoint 1mm SMD Pad  [TP_SMD_1.0MM]  (value not drawn)  (no BOM)
TP3  Testpoint 1mm SMD Pad  [TP_SMD_1.0MM]  (value not drawn)  (no BOM)
U2  value DC DC 0.8-6V 10A  MFG_PART_NO: LMZ12010TZ/NOPB  [LMZ12010TZENOPB]  (hidden comment: DC DC CONVERTER 0.8-6V 10A)
U3  MFG_PART_NO: LM3488MM/NOPB  [SOP65P490X110-8N]  (hidden comment: IC REG CTRLR MULT TOP 8VSSOP)
U4  MFG_PART_NO: R-78E3.3-0.5  [SHDRV3W100P0_254_1X3_1160X850X1040P]  (hidden comment: DC DC CONVERTER 3.3V 2W)

### Nets
3.3V: C15.2 R27.2 TP3.1 U4.3(+VOUT)
5.0V: C4.1 C5.2 R16.2 R17.2 TP1.1 U2.10(VOUT_1) U2.11(VOUT_2)
12.0V: C8.1 D6.K R18.2 R20.2 TP2.1
12.0V_Relay: D7.K SW1.2
GND: C2.2 C3.2 C4.2 C5.1 C7.1 C8.2 C9.2 C10.1 C11.1 C12.1 C13.2 C14.1 C15.1 D7.A L1.3 LED1.K LED2.K LED3.K LED4.K R19.1 R23.1 R24.1 R25.1 SW1.1 U2.3(AGND_1) U2.5(AGND_2) U2.6(AGND_3) U2.12(AGND_4) U3.4(AGND) U3.5(PGND) U4.2(GND)
VBATT: C2.1 C3.1 C9.1 C10.2 C14.2 L1.4 SW1.4 U2.1(VIN_1) U2.2(VIN_2) U3.8(VIN) U4.1(+VIN)
VBATT_RELAY: R26.2 SW1.3
FB: R18.1 R25.2 U3.3(FB)  [project net FB_4]
NetC1_1: C1.1 L1.2 Q1.4(D)
NetC1_2: C1.2 D6.A L1.1
NetC7_2: C7.2 U2.8(SS)
NetC11_2: C11.2 R22.2 U3.2(COMP)
NetC12_2: C12.2 R21.1 U3.1(ISENSE)
NetC13_1: C13.1 R22.1
NetLED1_A: LED1.A R16.1
NetLED2_A: LED2.A R20.1
NetLED3_A: LED3.A R26.1
NetLED4_A: LED4.A R27.1
NetQ1_1: Q1.1(G) U3.6(DR)
NetQ1_3: Q1.3(S) R21.2 R24.2
NetR17_1: R17.1 R19.2 U2.7(FB)
NetR23_2: R23.2 U3.7(FA/SD)

Not connected (* = marked no-connect by the designer): U2 4(EN) 9(NC)

### Notes on the sheet
- 12.0V
- 5.0V
- (near TP2) 12V 2A (24W)
- 11 - 17Vin
- 3.3V
- Safety Relays
- Title:
- Project:
- Size:
- Date:
- DrawnBy:
- Rev:
- Project Lead:
- Sheet
- Dhrumil Parikh
- of
- 200 University Ave W
- Waterloo, ON
- N2L 3G1, Canada
- File:

### Library data of the parts
C1 = CAP CER 4.7UF 35V X5R 0805: MFG_PART_NO: GRM219R6YA475KA73D; MFG: Murata Electronics; COST: 0.40
C2 C3 C9 = CAP ALUM 33UF 20% 100V RADIAL: MFG_PART_NO: UPM2A330MPD1TD; MFG: Nichicon; COST: 0.18; TOLERANCE: 20%; DIELECTRIC: ALUM
C4 = CAP ALUM 330UF 20% 25V TH: MFG_PART_NO: ESL337M025AGMAA; MFG: KEMET; COST: 0.53; TOLERANCE: 20%
C5 = CAP CER 0.047UF 50V X7R 0603: MFG_PART_NO: CC0603KRX7R9BB473; MFG: Yageo; TOLERANCE: 10%; COST: 0.14; DIELECTRIC: X7R
C7 C13 = CAP CER 0.47UF 16V X7R 0603: MFG_PART_NO: CL10B474KO8NNNC; MFG: Samsung; TOLERANCE: 10%; COST: 0.14; DIELECTRIC: X7R
C8 = CAP CER 22UF 25V X7R 1210: MFG_PART_NO: TMK325B7226KMHP; MFG: Taiyo Yuden; TOLERANCE: 20%; DIELECTRIC: X7S; COST: 1.55
C10 = CAP CER 0.1UF 25V X7R 0603: MFG_PART_NO: CC0603KRX7R8BB104; MFG: Yageo; TOLERANCE: 10%; COST: 0.14; DIELECTRIC: X7R
C11 = CAP CER 2000PF 50V X7R 0603: MFG_PART_NO: CC0603KRX7R9BB202; MFG: Yageo; TOLERANCE: 10%; COST: 0.14; DIELECTRIC: X7R
C12 = CAP CER 750PF 50V X7R 0603: MFG_PART_NO: CC0603KRX7R9BB751; MFG: Yageo; TOLERANCE: 10%; COST: 0.16; DIELECTRIC: X7R
C14 C15 = CAP CER 10UF 25V X5R 0603: MFG_PART_NO: C1608X5R1E106M080AC; MFG: KEMET; TOLERANCE: 20%; COST: 0.14; DIELECTRIC: X5R
D6 = DIODE SCHOTTKY 100V 5A DO221AC: MFG_PART_NO: VSSAF510-M3/H; MFG: Vishay; VF: 750mV; COST: 0.55; CURRENT: 5A; VR: 100V
D7 = DIODE GEN PURP 400V 1A SMA: as D1 on sheet S3_Connectors; COST: 0.17
L1 = INDUCT ARRAY 2 COIL 9.654UH SMD: MFG_PART_NO: DRQ125-100-R; MFG: Eaton; VALUE: 9.654µH
LED1-LED4 = LED GREEN CLEAR 0805 SMD: MFG_PART_NO: 150080VS75000; MFG: Würth Elektronik; COST: 0.26
  LED2 LED4: VALUE: GREEN 0805
Q1 = MOSFET N-CH 60V 46A DPAK: MFG: ON Semiconductor; VALUE: 16mOhm @ 20A, 10V; COST: 0.97
R16 R20 R25-R27 = RES SMD 10K OHM 1% 1/10W 0603: as R10 on sheet S3_Connectors; COST: 0.15; TOLERANCE: 1%
R17 = RES SMD 5.62K OHM 1% 1/10W 0603: MFG_PART_NO: RC0603FR-075K62L; MFG: Yageo; COST: 0.15; TOLERANCE: 1%
R18 = RES SMD 84.5K OHM 1% 1/10W 0603: MFG_PART_NO: RC0603FR-0784K5L; MFG: Yageo; COST: 0.15; TOLERANCE: 1%
R19 = RES SMD 1.07K OHM 1% 1/10W 0603: MFG_PART_NO: RC0603FR-071K07L; MFG: Yageo; COST: 0.15; TOLERANCE: 1%
R21 = RES SMD 100 OHM 1% 1/10W 0603: MFG_PART_NO: RC0603FR-07100RL; MFG: Yageo; COST: 0.15; TOLERANCE: 1%
R22 = RES SMD 348 OHM 1% 1/10W 0603: MFG_PART_NO: RC0603FR-07348RL; MFG: Yageo; COST: 0.15; TOLERANCE: 1%
R23 = RES SMD 36K OHM 1% 0.15W 0603: MFG_PART_NO: RC0603FR-0736KL; MFG: Yageo; COST: 0.15; TOLERANCE: 1%
R24 = RES 0.013 OHM 1W 1206 WIDE: MFG_PART_NO: PRL1632-R013-F-T1; MFG: Susumu; TOLERANCE: 1%; COST: 1
SW1 = RELAY GEN PURPOSE SPST-NO 100A 12VDC: MFG: Omron; COST: 42.86; MFG_PART_NO: G7EB-1A DC12
TP1-TP3 = Testpoint 1mm SMD Pad: Testpoint 1.0mm SMD Pad; VALUE: TP_SMD_1.0MM; ROHS: Y; STATUS: CHECKED
U2 = DC DC CONVERTER 0.8-6V 10A: MFG: TI; COST: 24.09
U3 = IC REG CTRLR MULT TOP 8VSSOP: MFG: TI; VALUE: LM3488MM/NOPB; COST: 3.29
U4 = DC DC CONVERTER 3.3V 2W: MFG: Recom Power; COST: 3.86; VALUE: DC DC CONVERTER 3.3V 2W

## Sheet S5_Communications.SchDoc: Communications
size Tabloid; DrawnBy: Dhrumil Parikh; SheetNumber: 5; SheetTotal: 6; PageSetup: Record=PageOptions|CenterHorizontal=True|CenterVertical=True|PrintScale=0.62|XCorrection=1.00|YCorrection=1.00|PrintKind=1|BorderSize=5000000|LeftOffset=0|BottomOffset=0|Orientation=2|PaperLength=1000|PaperWidth=1000|Scale=100|PaperSource=7|PrintQuality=600|MediaType=1|DitherType=10|PaperKind=Letter|PrintScaleMode=1; PageSize: T
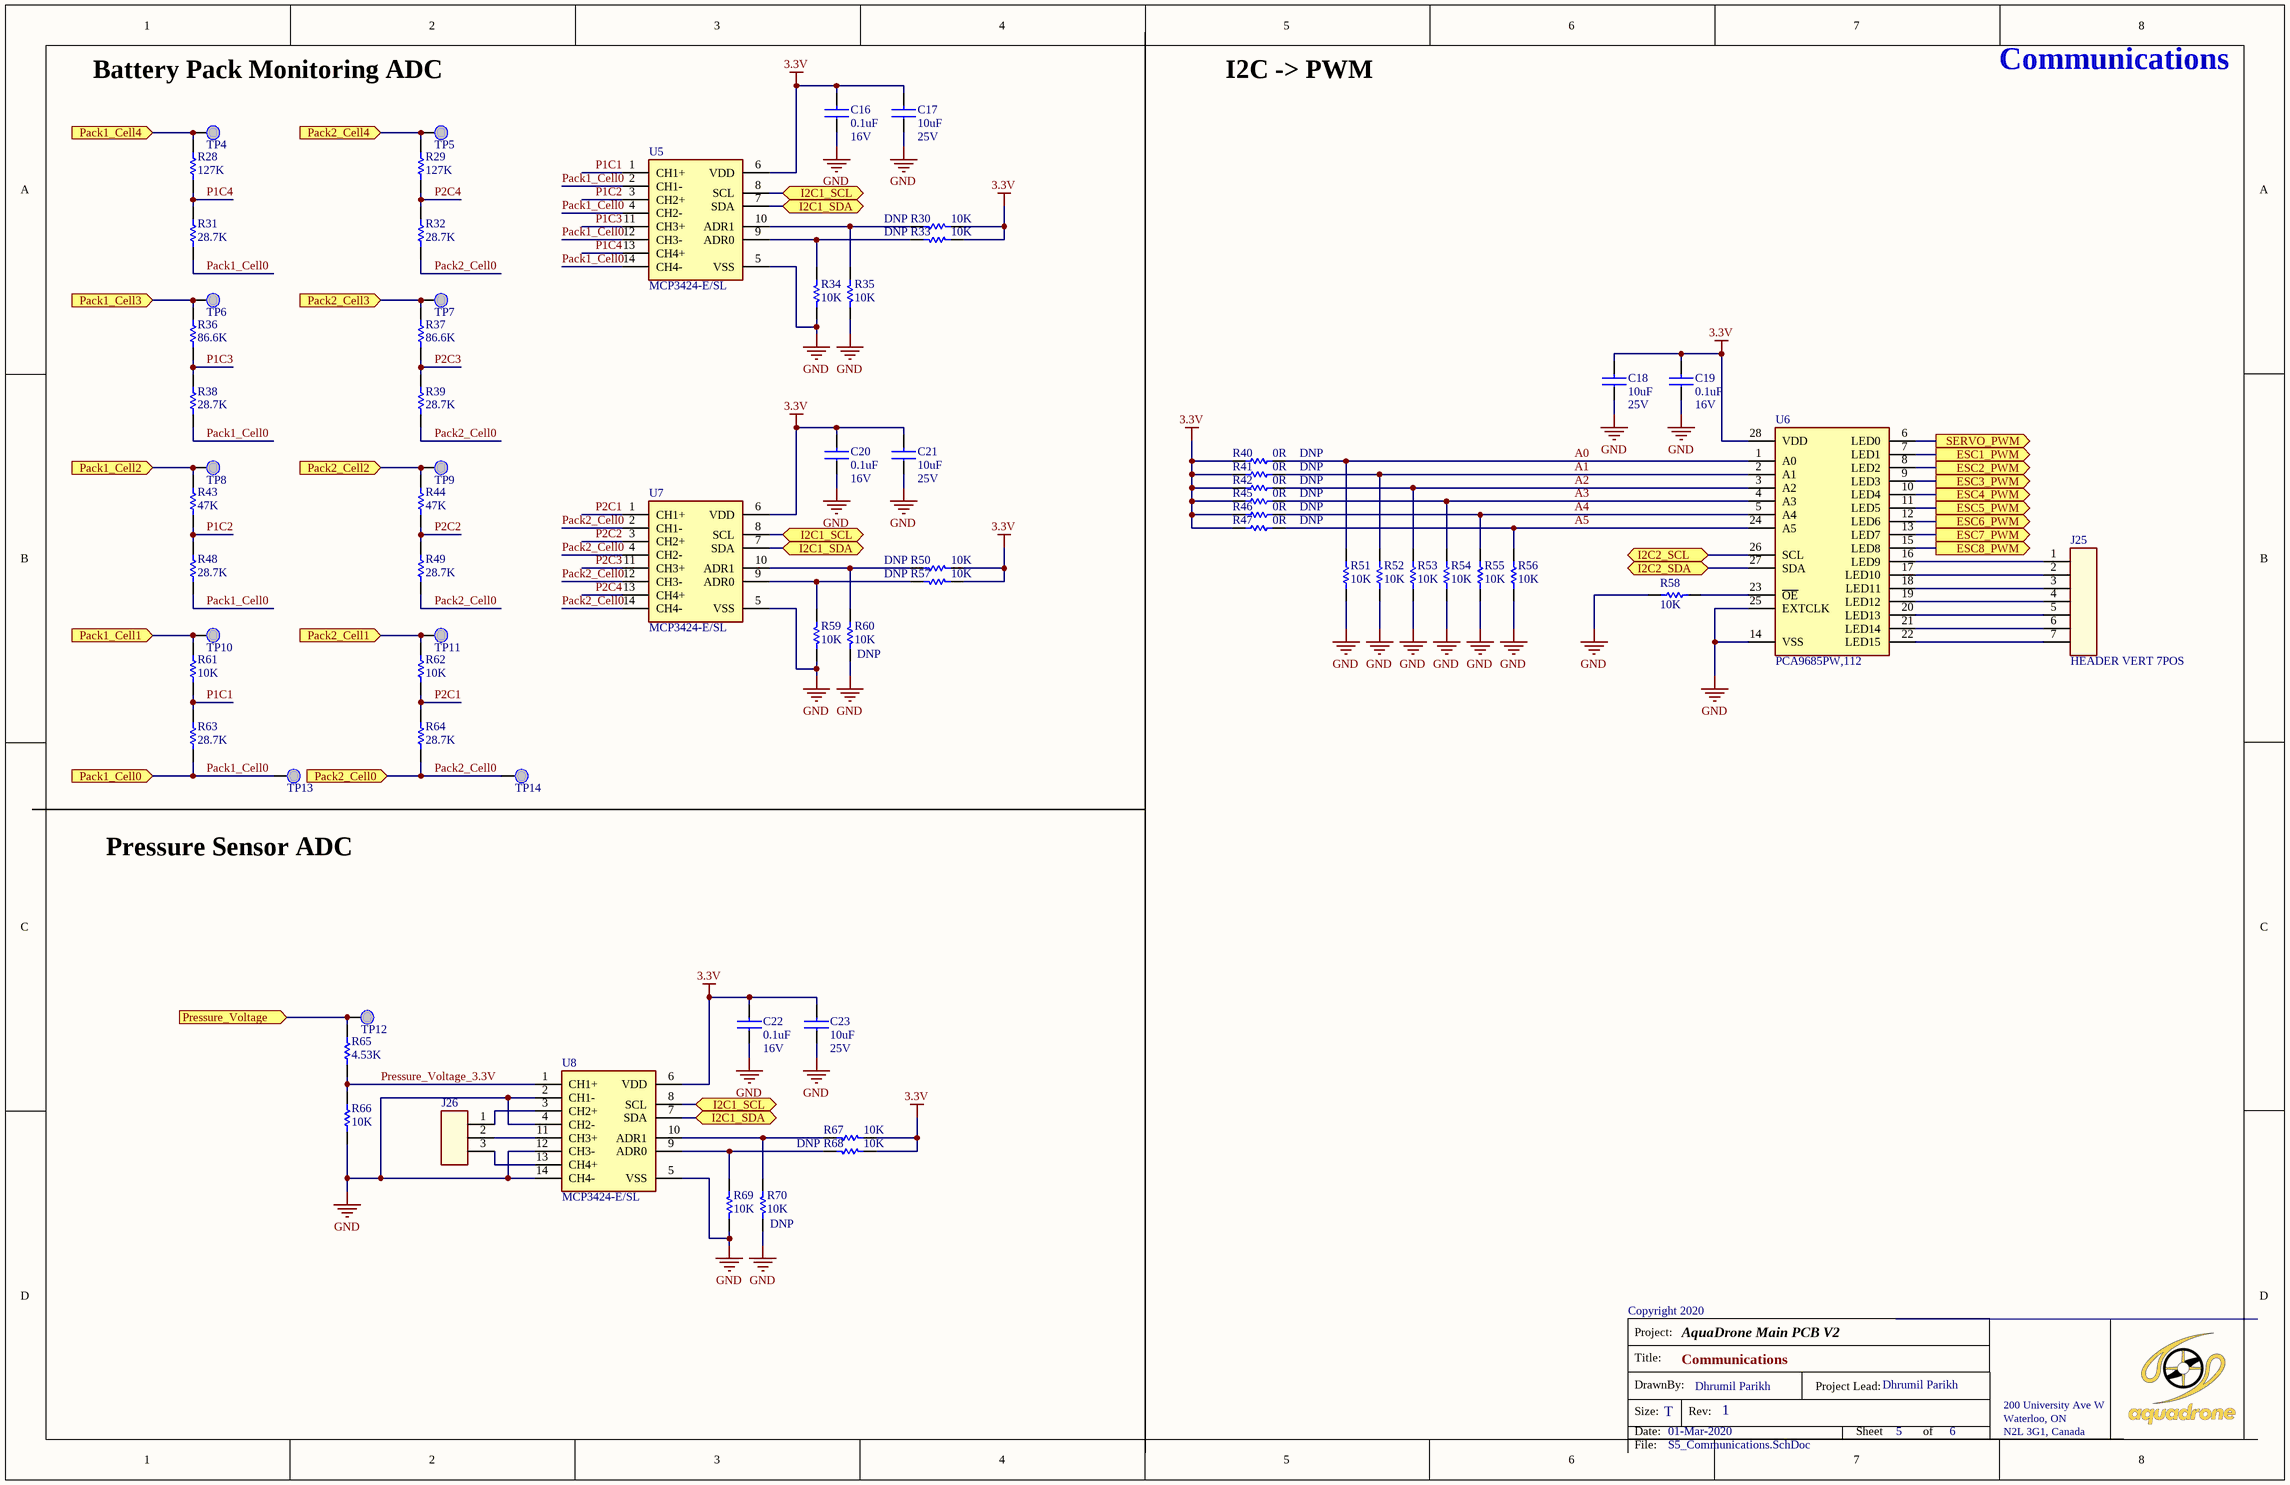
[diagram p3: S5_Communications.SchDoc]

### Parts
C16  value 0.1uF  VOLTAGE: 16V  [CAPC1608X09N]  (hidden comment: CAP CER 0.1UF 16V X7R 0603)
C17  value 10uF  VOLTAGE: 25V  [CAPC1608X09N]  (hidden comment: CAP CER 10UF 25V X5R 0603)
C18  value 10uF  VOLTAGE: 25V  [CAPC1608X09N]  (hidden comment: CAP CER 10UF 25V X5R 0603)
C19  value 0.1uF  VOLTAGE: 16V  [CAPC1608X09N]  (hidden comment: CAP CER 0.1UF 16V X7R 0603)
C20  value 0.1uF  VOLTAGE: 16V  [CAPC1608X09N]  (hidden comment: CAP CER 0.1UF 16V X7R 0603)
C21  value 10uF  VOLTAGE: 25V  [CAPC1608X09N]  (hidden comment: CAP CER 10UF 25V X5R 0603)
C22  value 0.1uF  VOLTAGE: 16V  [CAPC1608X09N]  (hidden comment: CAP CER 0.1UF 16V X7R 0603)
C23  value 10uF  VOLTAGE: 25V  [CAPC1608X09N]  (hidden comment: CAP CER 10UF 25V X5R 0603)
J25  value HEADER VERT 7POS  [61300711121]  (hidden comment: CONN HEADER VERT 7POS 2.54MM)
J26  CONN HEADER VERT 3POS 2.54MM  [61300311121]  (value not drawn)
R28  value 127K  [RESC1608X06N]  (hidden comment: RES SMD 127K OHM 1% 1/10W 0603)
R29  value 127K  [RESC1608X06N]  (hidden comment: RES SMD 127K OHM 1% 1/10W 0603)
R30  value 10K  NOSTUFF: DNP  [RESC1608X06N]  (hidden comment: RES SMD 10K OHM 1% 1/10W 0603)
R31  value 28.7K  [RESC1608X06N]  (hidden comment: RES SMD 28.7K OHM 1% 1/10W 0603)
R32  value 28.7K  [RESC1608X06N]  (hidden comment: RES SMD 28.7K OHM 1% 1/10W 0603)
R33  value 10K  NOSTUFF: DNP  [RESC1608X06N]  (hidden comment: RES SMD 10K OHM 1% 1/10W 0603)
R34  value 10K  [RESC1608X06N]  (hidden comment: RES SMD 10K OHM 1% 1/10W 0603)
R35  value 10K  [RESC1608X06N]  (hidden comment: RES SMD 10K OHM 1% 1/10W 0603)
R36  value 86.6K  [RESC1608X06N]  (hidden comment: RES SMD 86.6K OHM 1% 1/10W 0603)
R37  value 86.6K  [RESC1608X06N]  (hidden comment: RES SMD 86.6K OHM 1% 1/10W 0603)
R38  value 28.7K  [RESC1608X06N]  (hidden comment: RES SMD 28.7K OHM 1% 1/10W 0603)
R39  value 28.7K  [RESC1608X06N]  (hidden comment: RES SMD 28.7K OHM 1% 1/10W 0603)
R40  value 0R  NOSTUFF: DNP  [RESC2012X07N]  (hidden comment: RES SMD 0 OHM JUMPER 1/8W 0805)
R41  value 0R  NOSTUFF: DNP  [RESC2012X07N]  (hidden comment: RES SMD 0 OHM JUMPER 1/8W 0805)
R42  value 0R  NOSTUFF: DNP  [RESC2012X07N]  (hidden comment: RES SMD 0 OHM JUMPER 1/8W 0805)
R43  value 47K  [RESC1608X06N]  (hidden comment: RES SMD 47K OHM 1% 1/10W 0603)
R44  value 47K  [RESC1608X06N]  (hidden comment: RES SMD 47K OHM 1% 1/10W 0603)
R45  value 0R  NOSTUFF: DNP  [RESC2012X07N]  (hidden comment: RES SMD 0 OHM JUMPER 1/8W 0805)
R46  value 0R  NOSTUFF: DNP  [RESC2012X07N]  (hidden comment: RES SMD 0 OHM JUMPER 1/8W 0805)
R47  value 0R  NOSTUFF: DNP  [RESC2012X07N]  (hidden comment: RES SMD 0 OHM JUMPER 1/8W 0805)
R48  value 28.7K  [RESC1608X06N]  (hidden comment: RES SMD 28.7K OHM 1% 1/10W 0603)
R49  value 28.7K  [RESC1608X06N]  (hidden comment: RES SMD 28.7K OHM 1% 1/10W 0603)
R50  value 10K  NOSTUFF: DNP  [RESC1608X06N]  (hidden comment: RES SMD 10K OHM 1% 1/10W 0603)
R51  value 10K  [RESC1608X06N]  (hidden comment: RES SMD 10K OHM 1% 1/10W 0603)
R52  value 10K  [RESC1608X06N]  (hidden comment: RES SMD 10K OHM 1% 1/10W 0603)
R53  value 10K  [RESC1608X06N]  (hidden comment: RES SMD 10K OHM 1% 1/10W 0603)
R54  value 10K  [RESC1608X06N]  (hidden comment: RES SMD 10K OHM 1% 1/10W 0603)
R55  value 10K  [RESC1608X06N]  (hidden comment: RES SMD 10K OHM 1% 1/10W 0603)
R56  value 10K  [RESC1608X06N]  (hidden comment: RES SMD 10K OHM 1% 1/10W 0603)
R57  value 10K  NOSTUFF: DNP  [RESC1608X06N]  (hidden comment: RES SMD 10K OHM 1% 1/10W 0603)
R58  value 10K  [RESC1608X06N]  (hidden comment: RES SMD 10K OHM 1% 1/10W 0603)
R59  value 10K  [RESC1608X06N]  (hidden comment: RES SMD 10K OHM 1% 1/10W 0603)
R60  value 10K  NOSTUFF: DNP  [RESC1608X06N]  (hidden comment: RES SMD 10K OHM 1% 1/10W 0603)
R61  value 10K  [RESC1608X06N]  (hidden comment: RES SMD 10K OHM 1% 1/10W 0603)
R62  value 10K  [RESC1608X06N]  (hidden comment: RES SMD 10K OHM 1% 1/10W 0603)
R63  value 28.7K  [RESC1608X06N]  (hidden comment: RES SMD 28.7K OHM 1% 1/10W 0603)
R64  value 28.7K  [RESC1608X06N]  (hidden comment: RES SMD 28.7K OHM 1% 1/10W 0603)
R65  value 4.53K  [RESC1608X06N]  (hidden comment: RES SMD 4.53K OHM 1% 1/10W 0603)
R66  value 10K  [RESC1608X06N]  (hidden comment: RES SMD 10K OHM 1% 1/10W 0603)
R67  value 10K  [RESC1608X06N]  (hidden comment: RES SMD 10K OHM 1% 1/10W 0603)
R68  value 10K  NOSTUFF: DNP  [RESC1608X06N]  (hidden comment: RES SMD 10K OHM 1% 1/10W 0603)
R69  value 10K  [RESC1608X06N]  (hidden comment: RES SMD 10K OHM 1% 1/10W 0603)
R70  value 10K  NOSTUFF: DNP  [RESC1608X06N]  (hidden comment: RES SMD 10K OHM 1% 1/10W 0603)
TP4  Testpoint 1mm SMD Pad  [TP_SMD_1.0MM]  (value not drawn)  (no BOM)
TP5  Testpoint 1mm SMD Pad  [TP_SMD_1.0MM]  (value not drawn)  (no BOM)
TP6  Testpoint 1mm SMD Pad  [TP_SMD_1.0MM]  (value not drawn)  (no BOM)
TP7  Testpoint 1mm SMD Pad  [TP_SMD_1.0MM]  (value not drawn)  (no BOM)
TP8  Testpoint 1mm SMD Pad  [TP_SMD_1.0MM]  (value not drawn)  (no BOM)
TP9  Testpoint 1mm SMD Pad  [TP_SMD_1.0MM]  (value not drawn)  (no BOM)
TP10  Testpoint 1mm SMD Pad  [TP_SMD_1.0MM]  (value not drawn)  (no BOM)
TP11  Testpoint 1mm SMD Pad  [TP_SMD_1.0MM]  (value not drawn)  (no BOM)
TP12  Testpoint 1mm SMD Pad  [TP_SMD_1.0MM]  (value not drawn)  (no BOM)
TP13  Testpoint 1mm SMD Pad  [TP_SMD_1.0MM]  (value not drawn)  (no BOM)
TP14  Testpoint 1mm SMD Pad  [TP_SMD_1.0MM]  (value not drawn)  (no BOM)
U5  MFG_PART_NO: MCP3424-E/SL  [SOIC127P600X175-14N]  (hidden comment: IC ADC 18BIT SIGMA-DELTA 14SOIC)
U6  MFG_PART_NO: PCA9685PW,112  [SOP65P640X110-28N]  (hidden comment: IC LED DRVR LIN DIM 25MA 28TSSOP)
U7  MFG_PART_NO: MCP3424-E/SL  [SOIC127P600X175-14N]  (hidden comment: IC ADC 18BIT SIGMA-DELTA 14SOIC)
U8  MFG_PART_NO: MCP3424-E/SL  [SOIC127P600X175-14N]  (hidden comment: IC ADC 18BIT SIGMA-DELTA 14SOIC)

### Ports
ESC1_PWM (out), ESC2_PWM (out), ESC3_PWM (out), ESC4_PWM (out), ESC5_PWM (out), ESC6_PWM (out), ESC7_PWM (out), ESC8_PWM (out), I2C1_SCL (bidir), I2C1_SDA (bidir), I2C2_SCL (bidir), I2C2_SDA (bidir), Pack1_Cell0 (in), Pack1_Cell1 (in), Pack1_Cell2 (in), Pack1_Cell3 (in), Pack1_Cell4 (in), Pack2_Cell0 (in), Pack2_Cell1 (in), Pack2_Cell2 (in), Pack2_Cell3 (in), Pack2_Cell4 (in), Pressure_Voltage (in), SERVO_PWM (out)

### Nets
3.3V: C16.2 C17.2 C18.2 C19.2 C20.2 C21.2 C22.2 C23.2 R30.1 R33.1 R40.1 R41.1 R42.1 R45.1 R46.1 R47.1 R50.1 R57.1 R67.1 R68.1 U5.6(VDD) U6.28(VDD) U7.6(VDD) U8.6(VDD)
GND: C16.1 C17.1 C18.1 C19.1 C20.1 C21.1 C22.1 C23.1 R34.1 R35.1 R51.1 R52.1 R53.1 R54.1 R55.1 R56.1 R58.1 R59.1 R60.1 R66.1 R69.1 R70.1 U5.5(VSS) U6.14(VSS) U6.25(EXTCLK) U7.5(VSS) U8.2(CH1-) U8.4(CH2-) U8.5(VSS) U8.12(CH3-) U8.14(CH4-)
A0: R40.2 R51.2 U6.1(A0)  [project net A0_5]
A1: R41.2 R52.2 U6.2(A1)  [project net A1_5]
A2: R42.2 R53.2 U6.3(A2)  [project net A2_5]
A3: R45.2 R54.2 U6.4(A3)  [project net A3_5]
A4: R46.2 R55.2 U6.5(A4)  [project net A4_5]
A5: R47.2 R56.2 U6.24(A5)  [project net A5_5]
ESC1_PWM: U6.7(LED1) ; port ESC1_PWM
ESC2_PWM: U6.8(LED2) ; port ESC2_PWM
ESC3_PWM: U6.9(LED3) ; port ESC3_PWM
ESC4_PWM: U6.10(LED4) ; port ESC4_PWM
ESC5_PWM: U6.11(LED5) ; port ESC5_PWM
ESC6_PWM: U6.12(LED6) ; port ESC6_PWM
ESC7_PWM: U6.13(LED7) ; port ESC7_PWM
ESC8_PWM: U6.15(LED8) ; port ESC8_PWM
I2C1_SCL: U5.8(SCL) U7.8(SCL) U8.8(SCL) ; port I2C1_SCL
I2C1_SDA: U5.7(SDA) U7.7(SDA) U8.7(SDA) ; port I2C1_SDA
I2C2_SCL: U6.26(SCL) ; port I2C2_SCL
I2C2_SDA: U6.27(SDA) ; port I2C2_SDA
P1C1: R61.1 R63.2 U5.1(CH1+)  [project net P1C1_5]
P1C2: R43.1 R48.2 U5.3(CH2+)  [project net P1C2_5]
P1C3: R36.1 R38.2 U5.11(CH3+)  [project net P1C3_5]
P1C4: R28.1 R31.2 U5.13(CH4+)  [project net P1C4_5]
P2C1: R62.1 R64.2 U7.1(CH1+)  [project net P2C1_5]
P2C2: R44.1 R49.2 U7.3(CH2+)  [project net P2C2_5]
P2C3: R37.1 R39.2 U7.11(CH3+)  [project net P2C3_5]
P2C4: R29.1 R32.2 U7.13(CH4+)  [project net P2C4_5]
Pack1_Cell0: R31.1 R38.1 R48.1 R63.1 TP13.1 U5.2(CH1-) U5.4(CH2-) U5.12(CH3-) U5.14(CH4-) ; port Pack1_Cell0
Pack1_Cell1: R61.2 TP10.1 ; port Pack1_Cell1
Pack1_Cell2: R43.2 TP8.1 ; port Pack1_Cell2
Pack1_Cell3: R36.2 TP6.1 ; port Pack1_Cell3
Pack1_Cell4: R28.2 TP4.1 ; port Pack1_Cell4
Pack2_Cell0: R32.1 R39.1 R49.1 R64.1 TP14.1 U7.2(CH1-) U7.4(CH2-) U7.12(CH3-) U7.14(CH4-) ; port Pack2_Cell0
Pack2_Cell1: R62.2 TP11.1 ; port Pack2_Cell1
Pack2_Cell2: R44.2 TP9.1 ; port Pack2_Cell2
Pack2_Cell3: R37.2 TP7.1 ; port Pack2_Cell3
Pack2_Cell4: R29.2 TP5.1 ; port Pack2_Cell4
Pressure_Voltage: R65.2 TP12.1 ; port Pressure_Voltage
Pressure_Voltage_3.3V: R65.1 R66.2 U8.1(CH1+)  [project net Pressure_Voltage_3.3V_5]
SERVO_PWM: U6.6(LED0) ; port SERVO_PWM
NetJ25_1: J25.1 U6.16(LED9)
NetJ25_2: J25.2 U6.17(LED10)
NetJ25_3: J25.3 U6.18(LED11)
NetJ25_4: J25.4 U6.19(LED12)
NetJ25_5: J25.5 U6.20(LED13)
NetJ25_6: J25.6 U6.21(LED14)
NetJ25_7: J25.7 U6.22(LED15)
NetJ26_1: J26.1 U8.3(CH2+)
NetJ26_2: J26.2 U8.11(CH3+)
NetJ26_3: J26.3 U8.13(CH4+)
NetR30_2: R30.2 R35.2 U5.10(ADR1)
NetR33_2: R33.2 R34.2 U5.9(ADR0)
NetR50_2: R50.2 R60.2 U7.10(ADR1)
NetR57_2: R57.2 R59.2 U7.9(ADR0)
NetR58_2: R58.2 U6.23(~{OE})
NetR67_2: R67.2 R70.2 U8.10(ADR1)
NetR68_2: R68.2 R69.2 U8.9(ADR0)

### Notes on the sheet
- Battery Pack Monitoring ADC
- I2C -> PWM
- Pressure Sensor ADC
- Title:
- Project:
- Size:
- Date:
- DrawnBy:
- Rev:
- Project Lead:
- Sheet
- Dhrumil Parikh
- of
- 200 University Ave W
- Waterloo, ON
- N2L 3G1, Canada
- File:

### Library data of the parts
C16 C19 C20 C22 = CAP CER 0.1UF 16V X7R 0603: MFG_PART_NO: C0603C104M4RACTU; MFG: KEMET; TOLERANCE: 20%; COST: 0.14; DIELECTRIC: X7R
C17 C18 C21 C23 = CAP CER 10UF 25V X5R 0603: as C14 on sheet S4_Power_Supply; COST: 0.14; DIELECTRIC: X5R
J25 = CONN HEADER VERT 7POS 2.54MM: MFG: Wurth Electronics Inc.; COST: 0.53; MFG_PART_NO: 61300711121
J26 = CONN HEADER VERT 3POS 2.54MM: MFG: Wurth Electronics Inc.; COST: 0.18; MFG_PART_NO: 61300311121; VALUE: HEADER VERT 3POS
R28 R29 = RES SMD 127K OHM 1% 1/10W 0603: MFG_PART_NO: CRCW0603127KFKEA; MFG: Vishay Dale; COST: 0.15; TOLERANCE: 1%
R30 R33-R35 R50-R62 R66-R70 = RES SMD 10K OHM 1% 1/10W 0603: as R10 on sheet S3_Connectors; COST: 0.15; TOLERANCE: 1%
R31 R32 R38 R39 R48 R49 R63 R64 = RES SMD 28.7K OHM 1% 1/10W 0603: MFG_PART_NO: RC0603FR-0728K7L; MFG: Yageo; COST: 0.15; TOLERANCE: 1%
R36 R37 = RES SMD 86.6K OHM 1% 1/10W 0603: MFG_PART_NO: RC0603FR-0786K6L; MFG: Yageo; COST: 0.15; TOLERANCE: 1%
R40-R42 R45-R47 = RES SMD 0 OHM JUMPER 1/8W 0805: as R1 on sheet S3_Connectors; COST: 0.15
R43 R44 = RES SMD 47K OHM 1% 1/10W 0603: MFG_PART_NO: RC0603FR-0747KL; MFG: Yageo; COST: 0.15; TOLERANCE: 1%
R65 = RES SMD 4.53K OHM 1% 1/10W 0603: MFG_PART_NO: RC0603FR-074K53L; MFG: Yageo; COST: 0.15; TOLERANCE: 1%
TP4-TP14 = Testpoint 1mm SMD Pad: as TP1 on sheet S4_Power_Supply; ROHS: Y; STATUS: CHECKED
U5 U7 U8 = IC ADC 18BIT SIGMA-DELTA 14SOIC: MFG: Microchip Technology; VALUE: MCP3424-E/SL; COST: 5.98
U6 = IC LED DRVR LIN DIM 25MA 28TSSOP: MFG: NXP USA Inc.; VALUE: PCA9685PW,112; COST: 3.46

## Sheet S6_Solenoid_Valve_Interlock.SchDoc: Solenoid Valve Interlock
size Tabloid; DrawnBy: Dhrumil Parikh; SheetNumber: 6; SheetTotal: 6; PageSetup: Record=PageOptions|CenterHorizontal=True|CenterVertical=True|PrintScale=0.62|XCorrection=1.00|YCorrection=1.00|PrintKind=1|BorderSize=5000000|LeftOffset=0|BottomOffset=0|Orientation=2|PaperLength=1000|PaperWidth=1000|Scale=100|PaperSource=7|PrintQuality=600|MediaType=1|DitherType=10|PaperKind=Letter|PrintScaleMode=1; PageSize: T
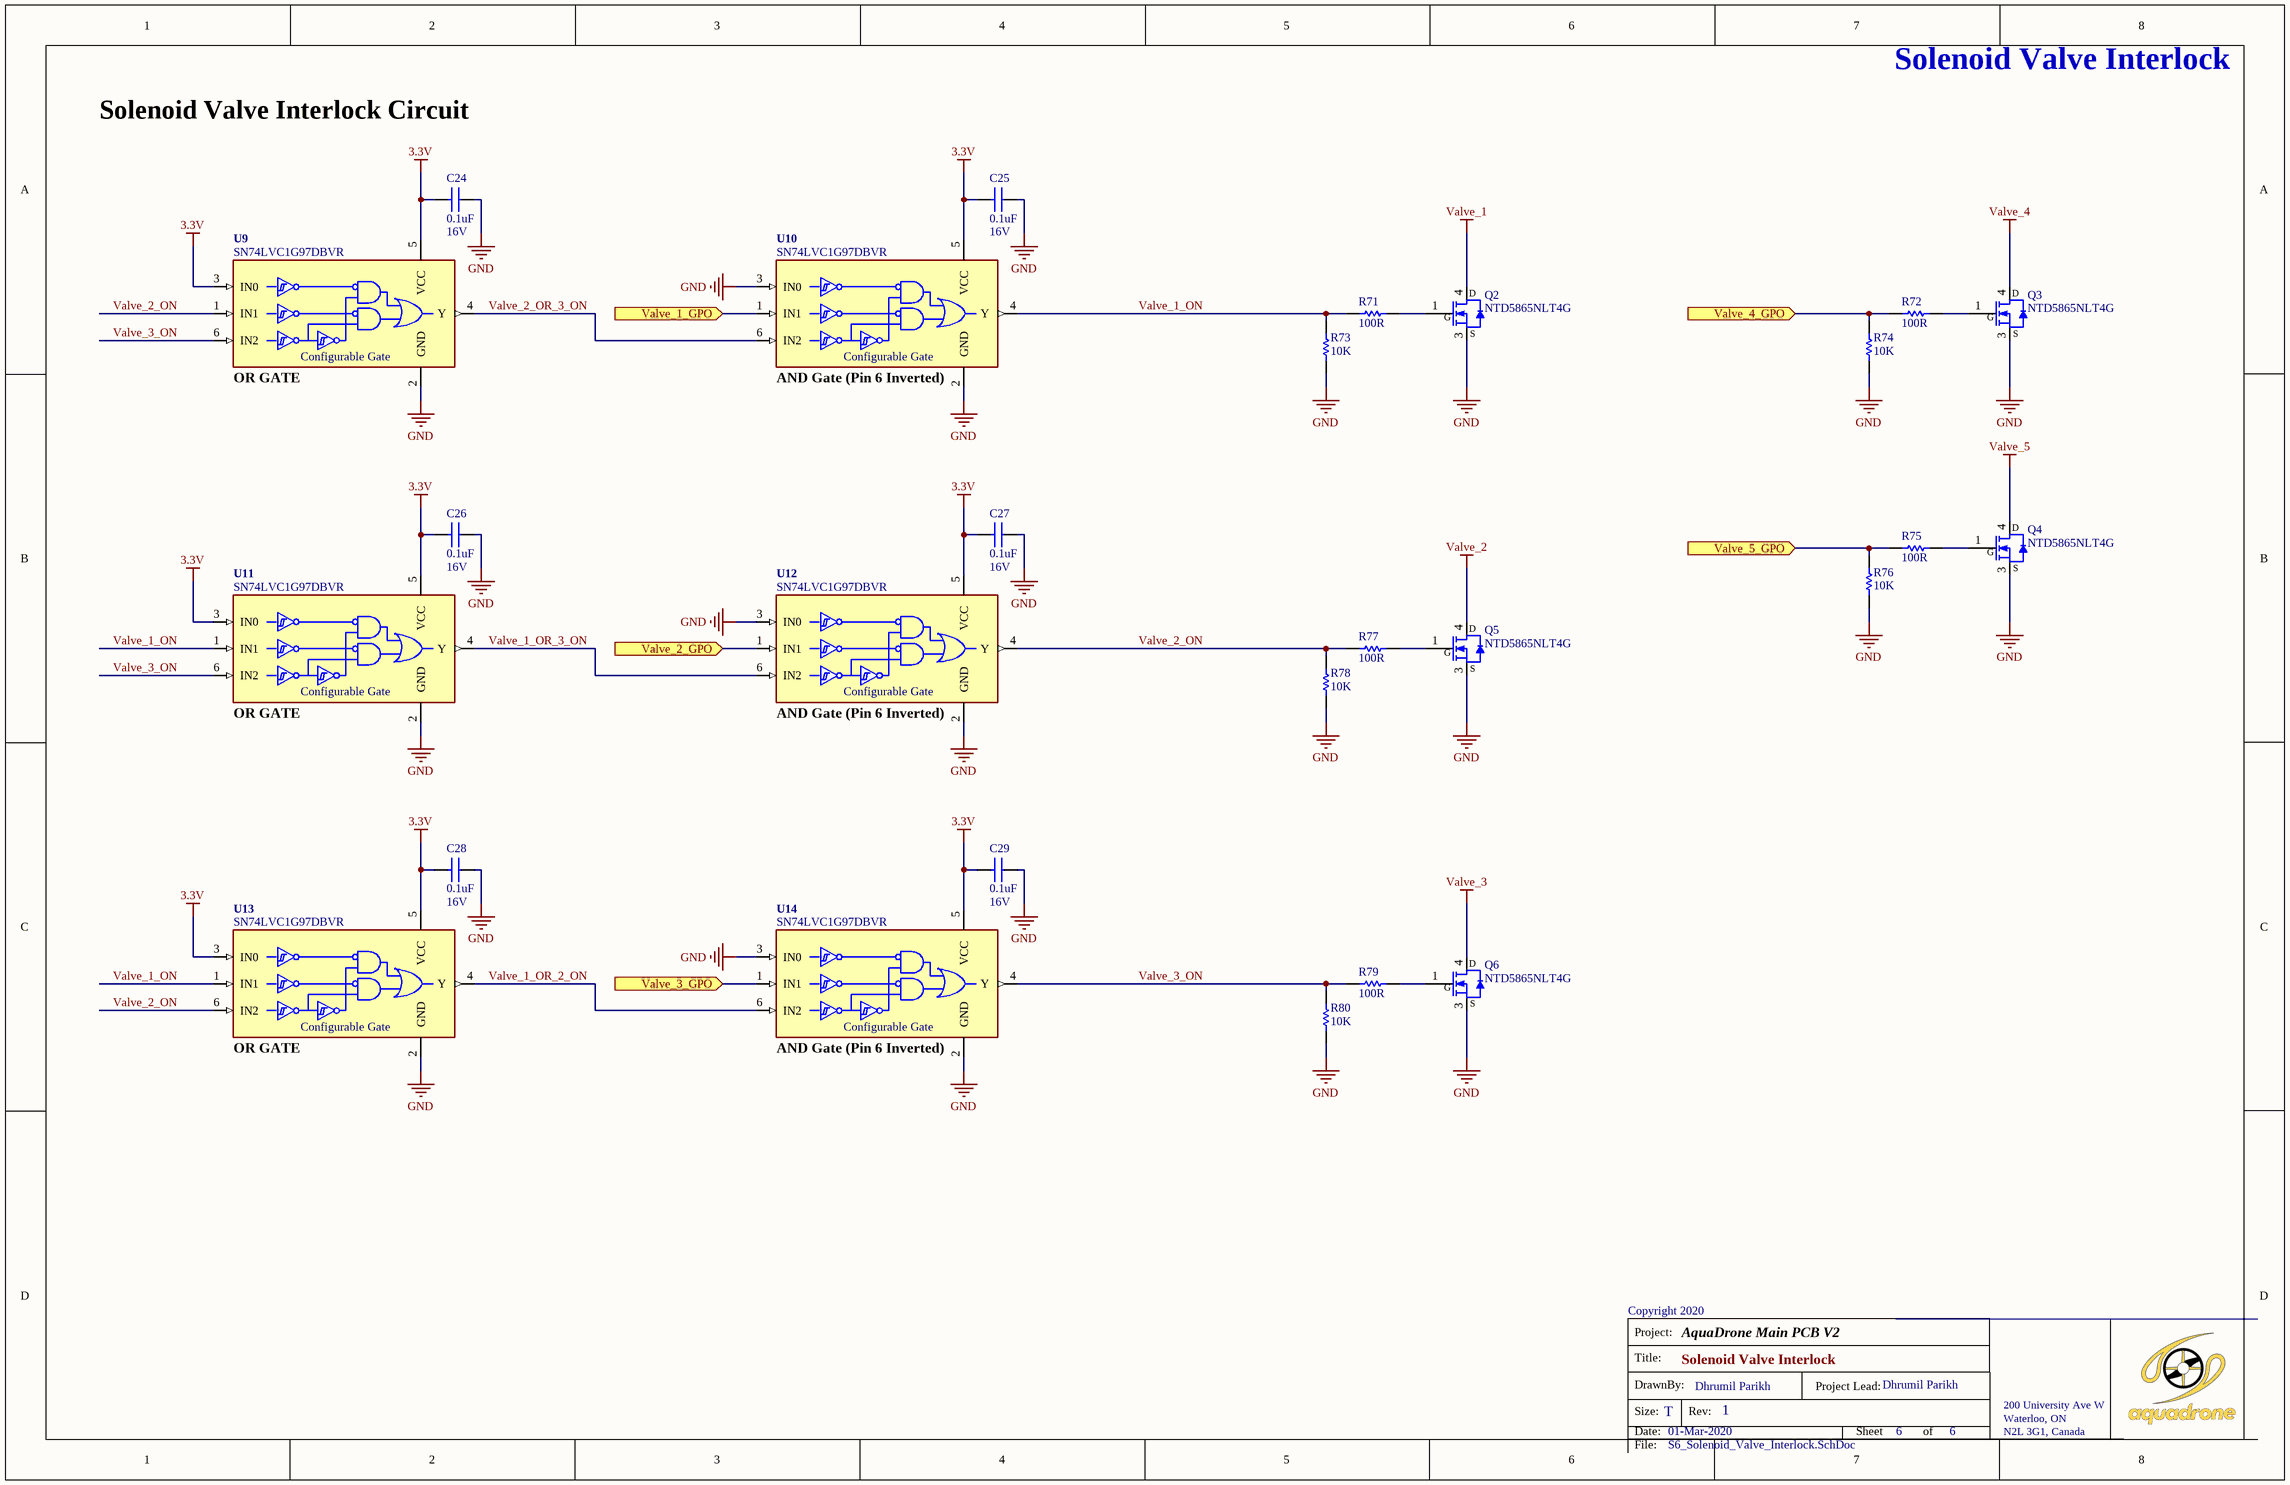
[diagram p4: S6_Solenoid_Valve_Interlock.SchDoc]

### Parts
C24  value 0.1uF  VOLTAGE: 16V  [CAPC1608X09N]  (hidden comment: CAP CER 0.1UF 16V X7R 0603)
C25  value 0.1uF  VOLTAGE: 16V  [CAPC1608X09N]  (hidden comment: CAP CER 0.1UF 16V X7R 0603)
C26  value 0.1uF  VOLTAGE: 16V  [CAPC1608X09N]  (hidden comment: CAP CER 0.1UF 16V X7R 0603)
C27  value 0.1uF  VOLTAGE: 16V  [CAPC1608X09N]  (hidden comment: CAP CER 0.1UF 16V X7R 0603)
C28  value 0.1uF  VOLTAGE: 16V  [CAPC1608X09N]  (hidden comment: CAP CER 0.1UF 16V X7R 0603)
C29  value 0.1uF  VOLTAGE: 16V  [CAPC1608X09N]  (hidden comment: CAP CER 0.1UF 16V X7R 0603)
Q2  MFG_PART_NO: NTD5865NLT4G  [TO229P990X238-4N]  (hidden comment: MOSFET N-CH 60V 46A DPAK)
Q3  MFG_PART_NO: NTD5865NLT4G  [TO229P990X238-4N]  (hidden comment: MOSFET N-CH 60V 46A DPAK)
Q4  MFG_PART_NO: NTD5865NLT4G  [TO229P990X238-4N]  (hidden comment: MOSFET N-CH 60V 46A DPAK)
Q5  MFG_PART_NO: NTD5865NLT4G  [TO229P990X238-4N]  (hidden comment: MOSFET N-CH 60V 46A DPAK)
Q6  MFG_PART_NO: NTD5865NLT4G  [TO229P990X238-4N]  (hidden comment: MOSFET N-CH 60V 46A DPAK)
R71  value 100R  [RESC1608X06N]  (hidden comment: RES SMD 100 OHM 1% 1/10W 0603)
R72  value 100R  [RESC1608X06N]  (hidden comment: RES SMD 100 OHM 1% 1/10W 0603)
R73  value 10K  [RESC1608X06N]  (hidden comment: RES SMD 10K OHM 1% 1/10W 0603)
R74  value 10K  [RESC1608X06N]  (hidden comment: RES SMD 10K OHM 1% 1/10W 0603)
R75  value 100R  [RESC1608X06N]  (hidden comment: RES SMD 100 OHM 1% 1/10W 0603)
R76  value 10K  [RESC1608X06N]  (hidden comment: RES SMD 10K OHM 1% 1/10W 0603)
R77  value 100R  [RESC1608X06N]  (hidden comment: RES SMD 100 OHM 1% 1/10W 0603)
R78  value 10K  [RESC1608X06N]  (hidden comment: RES SMD 10K OHM 1% 1/10W 0603)
R79  value 100R  [RESC1608X06N]  (hidden comment: RES SMD 100 OHM 1% 1/10W 0603)
R80  value 10K  [RESC1608X06N]  (hidden comment: RES SMD 10K OHM 1% 1/10W 0603)
U9  value SN74LVC1G97DBVR  [SOT65P210X110-6N_SN74LVC1G97DCK]  (hidden comment: IC CONFIG MULT-FUNC GATE SOT23-6)
U10  value SN74LVC1G97DBVR  [SOT65P210X110-6N_SN74LVC1G97DCK]  (hidden comment: IC CONFIG MULT-FUNC GATE SOT23-6)
U11  value SN74LVC1G97DBVR  [SOT65P210X110-6N_SN74LVC1G97DCK]  (hidden comment: IC CONFIG MULT-FUNC GATE SOT23-6)
U12  value SN74LVC1G97DBVR  [SOT65P210X110-6N_SN74LVC1G97DCK]  (hidden comment: IC CONFIG MULT-FUNC GATE SOT23-6)
U13  value SN74LVC1G97DBVR  [SOT65P210X110-6N_SN74LVC1G97DCK]  (hidden comment: IC CONFIG MULT-FUNC GATE SOT23-6)
U14  value SN74LVC1G97DBVR  [SOT65P210X110-6N_SN74LVC1G97DCK]  (hidden comment: IC CONFIG MULT-FUNC GATE SOT23-6)

### Ports
Valve_1_GPO (in), Valve_2_GPO (in), Valve_3_GPO (in), Valve_4_GPO (in), Valve_5_GPO (in)

### Nets
3.3V: C24.2 C25.2 C26.2 C27.2 C28.2 C29.2 U9.3(IN0) U9.5(VCC) U10.5(VCC) U11.3(IN0) U11.5(VCC) U12.5(VCC) U13.3(IN0) U13.5(VCC) U14.5(VCC)
GND: C24.1 C25.1 C26.1 C27.1 C28.1 C29.1 Q2.3(S) Q3.3(S) Q4.3(S) Q5.3(S) Q6.3(S) R73.1 R74.1 R76.1 R78.1 R80.1 U9.2(GND) U10.2(GND) U10.3(IN0) U11.2(GND) U12.2(GND) U12.3(IN0) U13.2(GND) U14.2(GND) U14.3(IN0)
Valve_1: Q2.4(D)
Valve_2: Q5.4(D)
Valve_3: Q6.4(D)
Valve_4: Q3.4(D)
Valve_5: Q4.4(D)
Valve_1_GPO: U10.1(IN1) ; port Valve_1_GPO
Valve_1_ON: R71.1 R73.2 U10.4(Y) U11.1(IN1) U13.1(IN1)  [project net Valve_1_ON_6]
Valve_1_OR_2_ON: U13.4(Y) U14.6(IN2)  [project net Valve_1_OR_2_ON_6]
Valve_1_OR_3_ON: U11.4(Y) U12.6(IN2)  [project net Valve_1_OR_3_ON_6]
Valve_2_GPO: U12.1(IN1) ; port Valve_2_GPO
Valve_2_ON: R77.1 R78.2 U9.1(IN1) U12.4(Y) U13.6(IN2)  [project net Valve_2_ON_6]
Valve_2_OR_3_ON: U9.4(Y) U10.6(IN2)  [project net Valve_2_OR_3_ON_6]
Valve_3_GPO: U14.1(IN1) ; port Valve_3_GPO
Valve_3_ON: R79.1 R80.2 U9.6(IN2) U11.6(IN2) U14.4(Y)  [project net Valve_3_ON_6]
Valve_4_GPO: R72.1 R74.2 ; port Valve_4_GPO
Valve_5_GPO: R75.1 R76.2 ; port Valve_5_GPO
NetQ2_1: Q2.1(G) R71.2
NetQ3_1: Q3.1(G) R72.2
NetQ4_1: Q4.1(G) R75.2
NetQ5_1: Q5.1(G) R77.2
NetQ6_1: Q6.1(G) R79.2

### Notes on the sheet
- Solenoid Valve Interlock Circuit
- (near U9) OR GATE
- (near U10) AND Gate (Pin 6 Inverted)
- (near U11) OR GATE
- (near U12) AND Gate (Pin 6 Inverted)
- (near U13) OR GATE
- (near U14) AND Gate (Pin 6 Inverted)
- Title:
- Project:
- Size:
- Date:
- DrawnBy:
- Rev:
- Project Lead:
- Sheet
- Dhrumil Parikh
- of
- 200 University Ave W
- Waterloo, ON
- N2L 3G1, Canada
- File:
- (in symbol IC CONFIG MULT-FUNC GATE SOT23-6) Configurable Gate

### Library data of the parts
C24-C29 = CAP CER 0.1UF 16V X7R 0603: as C16 on sheet S5_Communications; COST: 0.14; DIELECTRIC: X7R
Q2-Q6 = MOSFET N-CH 60V 46A DPAK: as Q1 on sheet S4_Power_Supply; COST: 0.97
R71 R72 R75 R77 R79 = RES SMD 100 OHM 1% 1/10W 0603: as R21 on sheet S4_Power_Supply; COST: 0.15; TOLERANCE: 1%
R73 R74 R76 R78 R80 = RES SMD 10K OHM 1% 1/10W 0603: as R10 on sheet S3_Connectors; COST: 0.15; TOLERANCE: 1%
U9-U14 = IC CONFIG MULT-FUNC GATE SOT23-6: MFG: TI; COST: 0.58; MFG_PART_NO: SN74LVC1G97DBVR

## Nets that join several sheets
3.3V: S3_Connectors (7 pins), S4_Power_Supply (C15.2 R27.2 TP3.1 U4.3), S5_Communications (24 pins), S6_Solenoid_Valve_Interlock (15 pins)
5.0V: S3_Connectors (6 pins), S4_Power_Supply (7 pins)
12.0V: S3_Connectors (11 pins), S4_Power_Supply (5 pins)
12.0V_Relay: S3_Connectors (J14.2), S4_Power_Supply (D7.K SW1.2)
GND: S3_Connectors (39 pins), S4_Power_Supply (31 pins), S5_Communications (31 pins), S6_Solenoid_Valve_Interlock (25 pins)
Valve_1: S3_Connectors (D1.A J2.2), S6_Solenoid_Valve_Interlock (Q2.4)
Valve_2: S3_Connectors (D2.A J3.2), S6_Solenoid_Valve_Interlock (Q5.4)
Valve_3: S3_Connectors (D3.A J4.2), S6_Solenoid_Valve_Interlock (Q6.4)
Valve_4: S3_Connectors (D4.A J5.2), S6_Solenoid_Valve_Interlock (Q3.4)
Valve_5: S3_Connectors (D5.A J6.2), S6_Solenoid_Valve_Interlock (Q4.4)
VBATT: S3_Connectors (J1.2 J10.2), S4_Power_Supply (11 pins)
VBATT_RELAY: S3_Connectors (8 pins), S4_Power_Supply (R26.2 SW1.3)
ESC1_PWM: S3_Connectors (ESC1.PWM), S5_Communications (U6.7)
ESC2_PWM: S3_Connectors (ESC2.PWM), S5_Communications (U6.8)
ESC3_PWM: S3_Connectors (ESC3.PWM), S5_Communications (U6.9)
ESC4_PWM: S3_Connectors (ESC4.PWM), S5_Communications (U6.10)
ESC5_PWM: S3_Connectors (ESC5.PWM), S5_Communications (U6.11)
ESC6_PWM: S3_Connectors (ESC7.PWM), S5_Communications (U6.12)
ESC7_PWM: S3_Connectors (ESC6.PWM), S5_Communications (U6.13)
ESC8_PWM: S3_Connectors (ESC8.PWM), S5_Communications (U6.15)
I2C1_SCL: S3_Connectors (J19.1 R4.2 R13.1 U1.5), S5_Communications (U5.8 U7.8 U8.8)
I2C1_SDA: S3_Connectors (J19.2 R3.1 R12.1 U1.4), S5_Communications (U5.7 U7.7 U8.7)
I2C2_SCL: S3_Connectors (R2.1 R11.1), S5_Communications (U6.26)
I2C2_SDA: S3_Connectors (R1.1 R10.1), S5_Communications (U6.27)
Pack1_Cell0: S3_Connectors (J7.5), S5_Communications (9 pins)
Pack1_Cell1: S3_Connectors (J7.4), S5_Communications (R61.2 TP10.1)
Pack1_Cell2: S3_Connectors (J7.3), S5_Communications (R43.2 TP8.1)
Pack1_Cell3: S3_Connectors (J7.2), S5_Communications (R36.2 TP6.1)
Pack1_Cell4: S3_Connectors (J7.1), S5_Communications (R28.2 TP4.1)
Pack2_Cell0: S3_Connectors (J11.5), S5_Communications (9 pins)
Pack2_Cell1: S3_Connectors (J11.4), S5_Communications (R62.2 TP11.1)
Pack2_Cell2: S3_Connectors (J11.3), S5_Communications (R44.2 TP9.1)
Pack2_Cell3: S3_Connectors (J11.2), S5_Communications (R37.2 TP7.1)
Pack2_Cell4: S3_Connectors (J11.1), S5_Communications (R29.2 TP5.1)
Pressure_Voltage: S3_Connectors (J18.2), S5_Communications (R65.2 TP12.1)
SERVO_PWM: S3_Connectors (J22.3), S5_Communications (U6.6)
Valve_1_GPO: S3_Connectors (R5.1), S6_Solenoid_Valve_Interlock (U10.1)
Valve_2_GPO: S3_Connectors (R6.1), S6_Solenoid_Valve_Interlock (U12.1)
Valve_3_GPO: S3_Connectors (R7.1), S6_Solenoid_Valve_Interlock (U14.1)
Valve_4_GPO: S3_Connectors (R8.1), S6_Solenoid_Valve_Interlock (R72.1 R74.2)
Valve_5_GPO: S3_Connectors (R9.1), S6_Solenoid_Valve_Interlock (R75.1 R76.2)